# Altium project trusted_io_dvt1.PrjPcb (part 1 of 2)
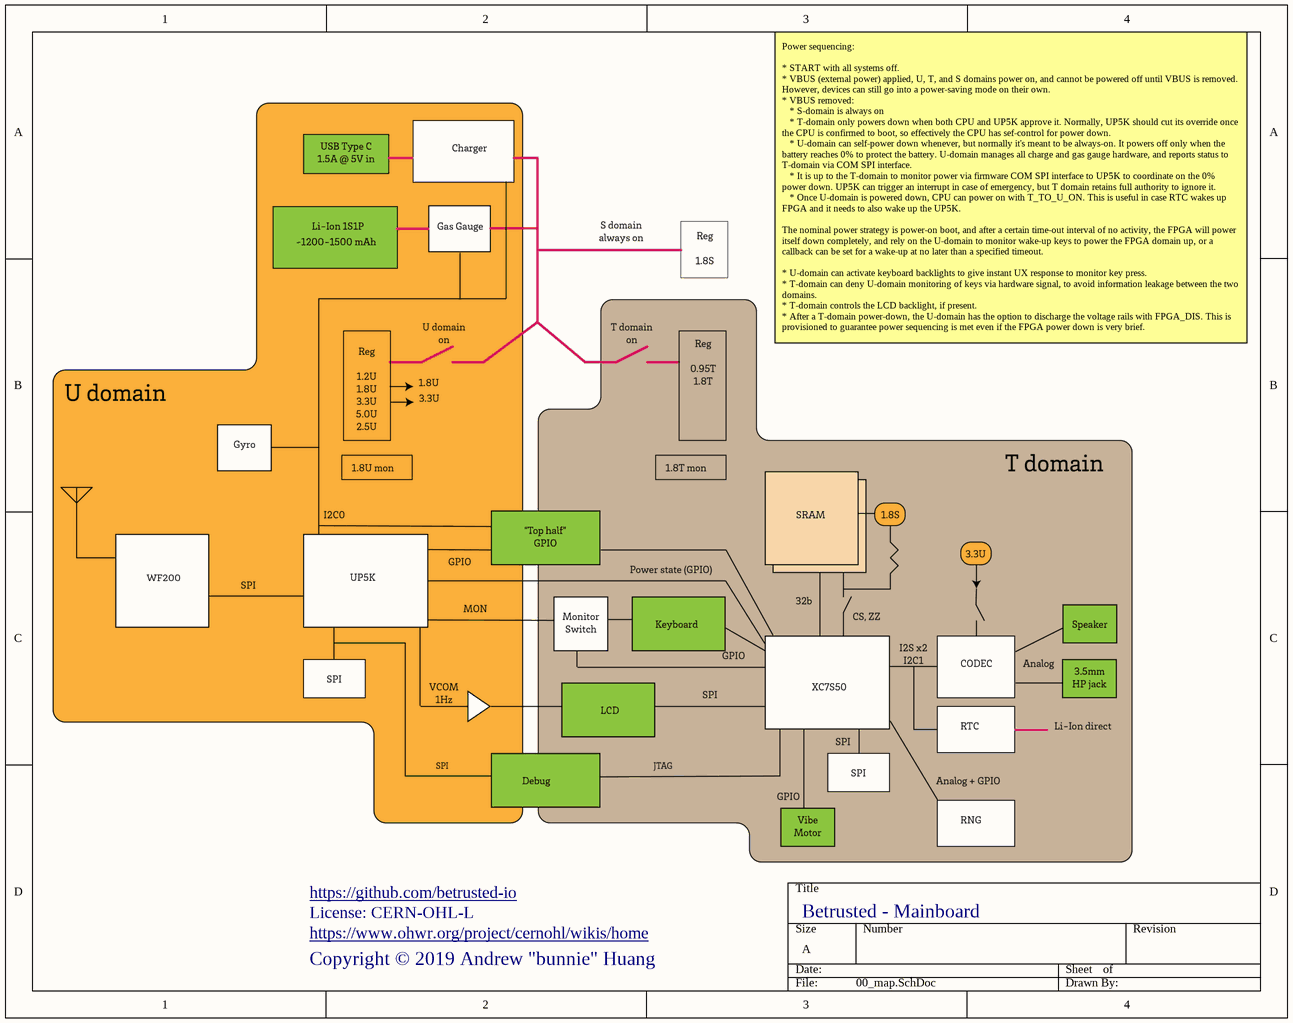
[diagram p0: 00_map.SchDoc]
8 sheets, 421 parts. Net scope: global (net labels, ports and power ports of the same name join across sheets).
Board file: betrusted_dvt1b-dfm.PcbDoc
Sheets:
  00_map.SchDoc
  01_fpga.SchDoc
  02_memory.SchDoc
  03_power.SchDoc
  04_io.SchDoc
  05_kbd_pm.SchDoc
  06_rng.SchDoc
  07_ux.SchDoc

## Sheet 00_map.SchDoc
size A

### Notes on the sheet
- Power sequencing:
  * START with all systems off.
  * VBUS (external power) applied, U, T, and S domains power on, and cannot be powered off until VBUS is removed. However, devices can still go into a power-saving mode on their own.
  * VBUS removed:
  * S-domain is always on
  * T-domain only powers down when both CPU and UP5K approve it. Normally, UP5K should cut its override once the CPU is confirmed to boot, so effectively the CPU has sef-control for power down.
  * U-domain can self-power down whenever, but normally it's meant to be always-on. It powers off only when the battery reaches 0% to protect the battery. U-domain manages all charge and gas gauge hardware, and reports status to T-domain via COM SPI interface.
  * It is up to the T-domain to monitor power via firmware COM SPI interface to UP5K to coordinate on the 0% power down. UP5K can trigger an interrupt in case of emergency, but T domain retains full authority to ignore it.
  * Once U-domain is powered down, CPU can power on with T_TO_U_ON. This is useful in case RTC wakes up FPGA and it needs to also wake up the UP5K.
  The nominal power strategy is power-on boot, and after a certain time-out interval of no activity, the FPGA will power itself down completely, and rely on the U-domain to monitor wake-up keys to power the FPGA domain up, or a callback can be set for a wake-up at no later than a specified timeout.
  * U-domain can activate keyboard backlights to give instant UX response to monitor key press.
  * T-domain can deny U-domain monitoring of keys via hardware signal, to avoid information leakage between the two domains.
  * T-domain controls the LCD backlight, if present.
  * After a T-domain power-down, the U-domain has the option to discharge the voltage rails with FPGA_DIS. This is provisioned to guarantee power sequencing is met even if the FPGA power down is very brief.
- https://github.com/betrusted-io
- License: CERN-OHL-L
- Copyright © 2019 Andrew "bunnie" Huang
- https://www.ohwr.org/project/cernohl/wikis/home
- Betrusted - Mainboard

## Sheet 01_fpga.SchDoc
size A2; VENDOR: TI; MPN: SN74AUC1G66YZPR; MYPN: U-SN74AUC1G66YZPR
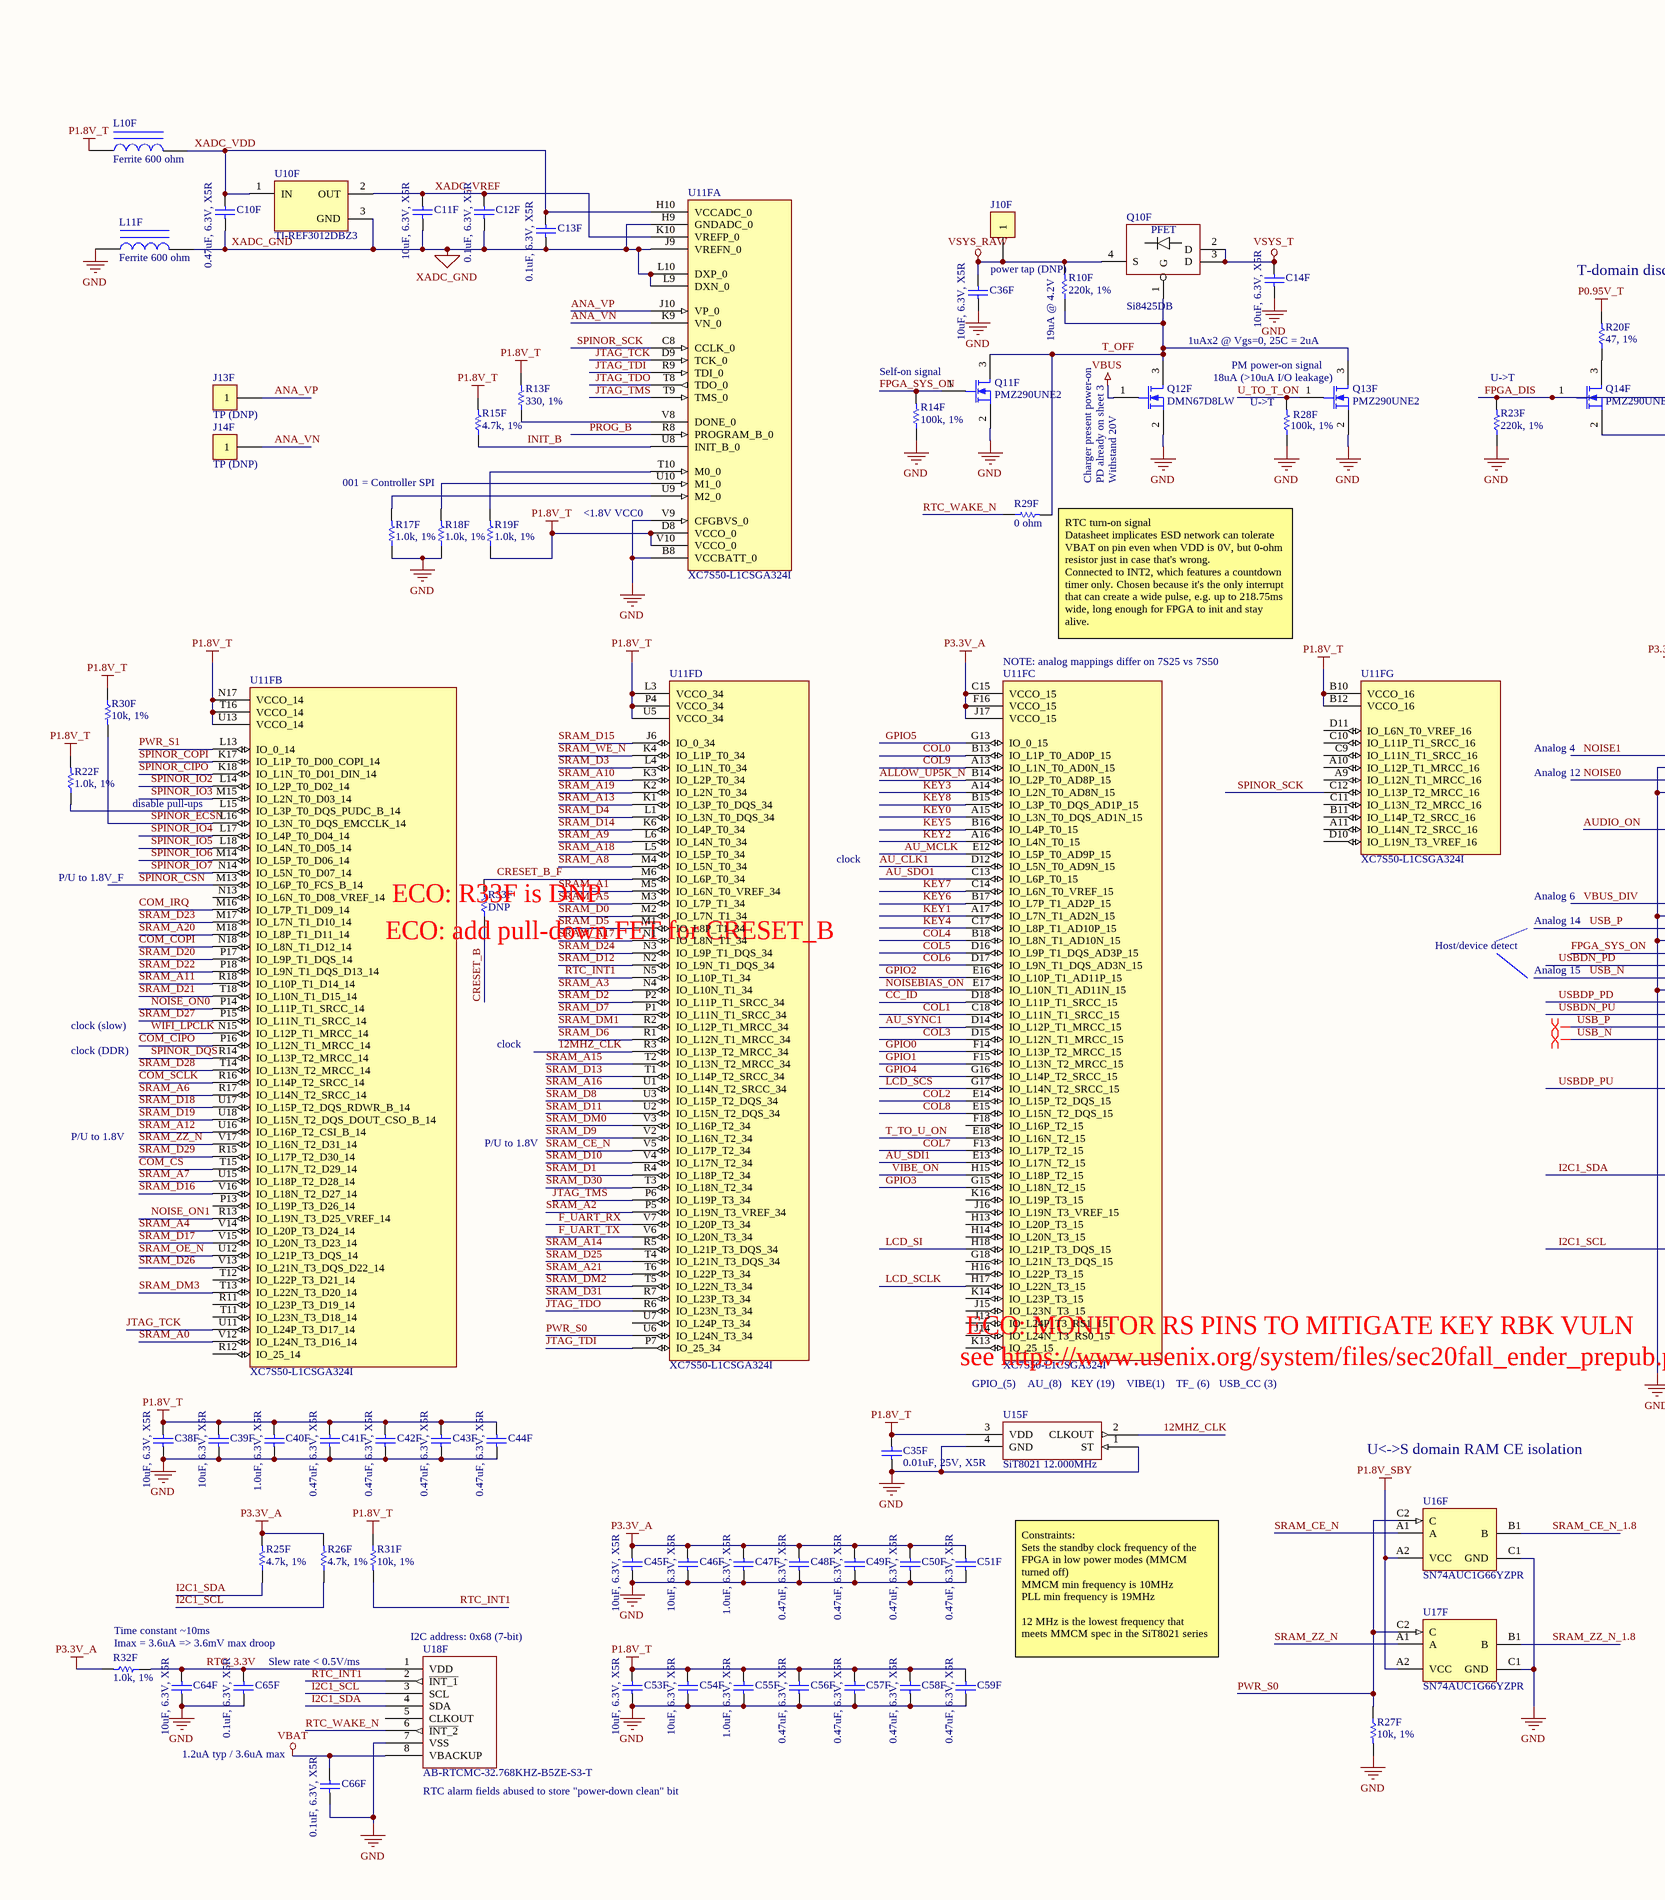
[diagram p1: 01_fpga.SchDoc, left]
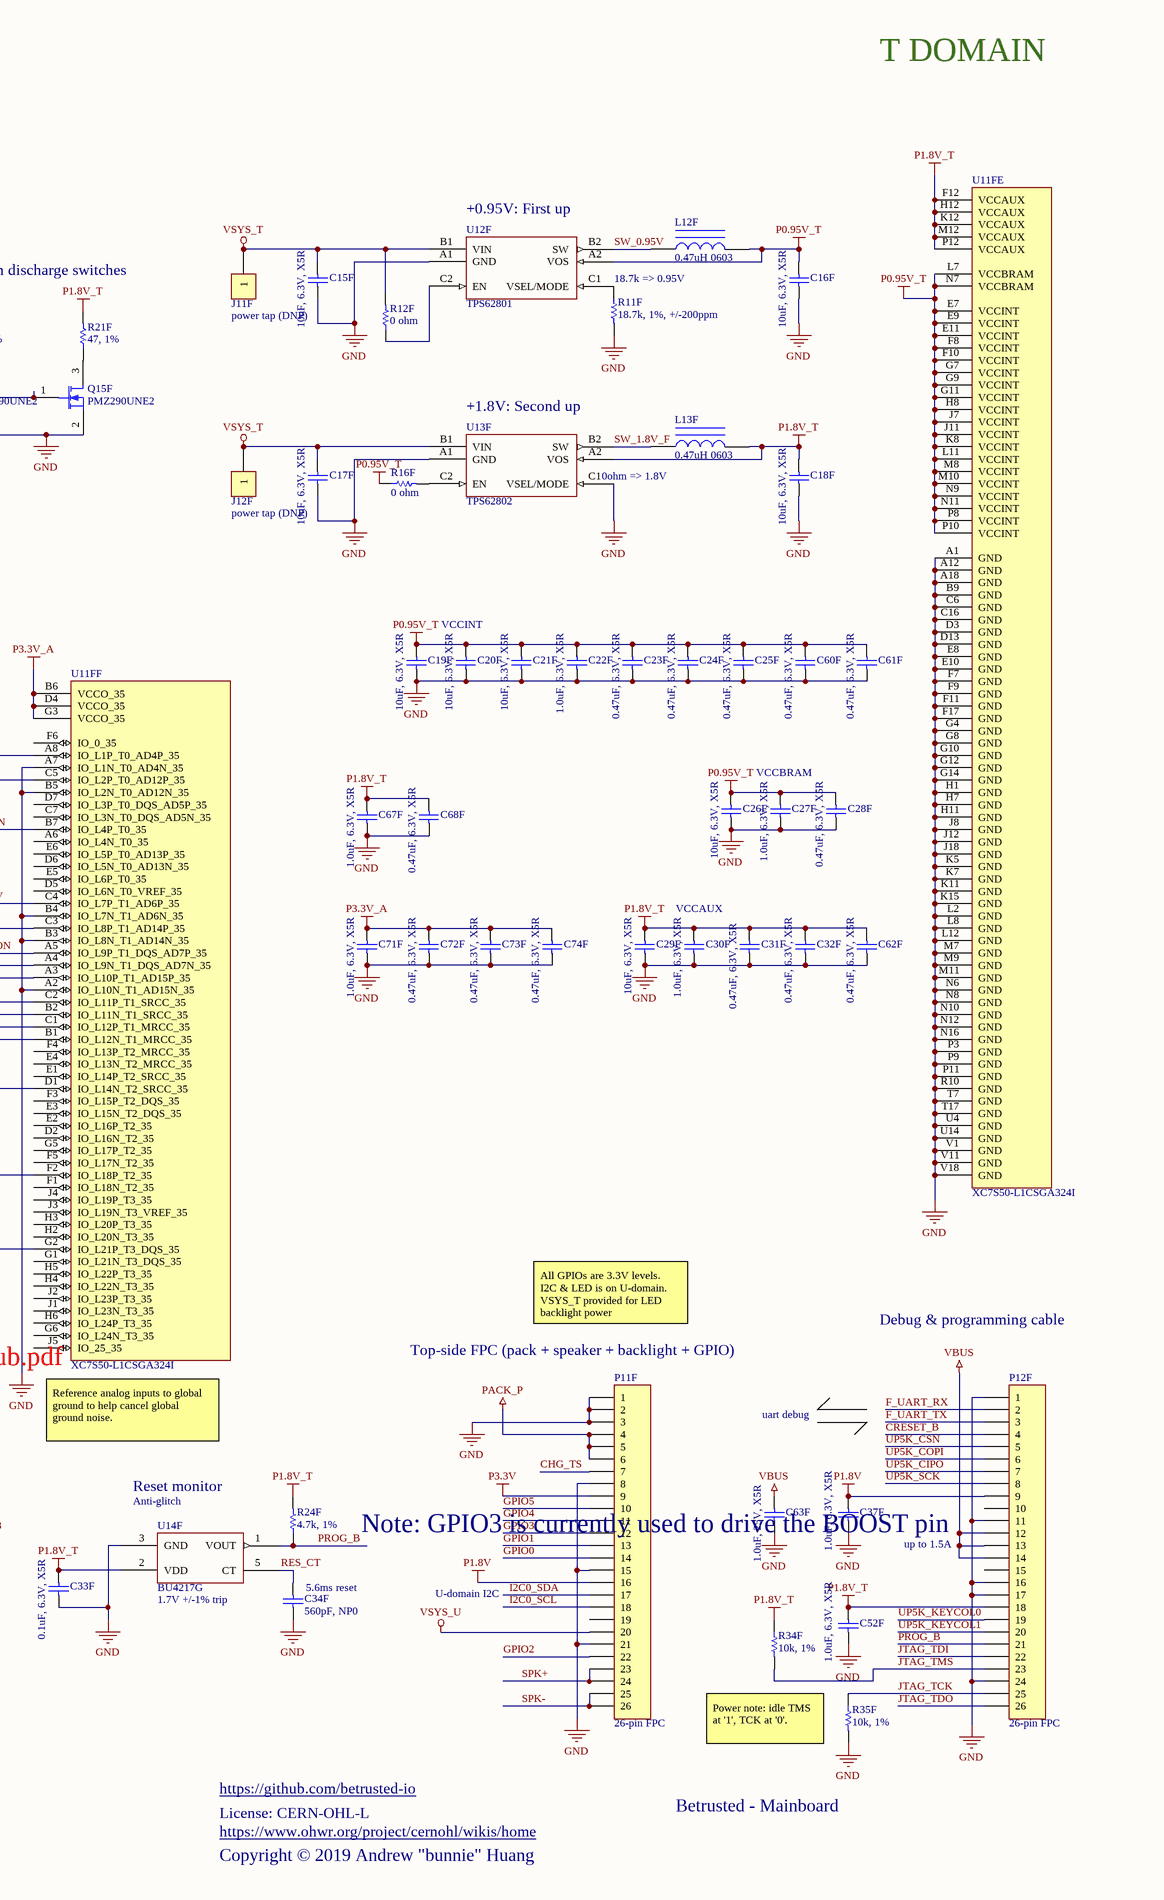
[diagram p2: 01_fpga.SchDoc, right]

### Parts
C10F  0.47uF, 6.3V, X5R  [B_CAP0201]
C11F  10uF, 6.3V, X5R  [B_CAP0603]
C12F  0.1uF, 6.3V, X5R  [B_CAP0201]
C13F  0.1uF, 6.3V, X5R  [B_CAP0201]
C14F  10uF, 6.3V, X5R  [B_CAP0603]
C15F  10uF, 6.3V, X5R  [B_CAP0603]
C16F  10uF, 6.3V, X5R  [B_CAP0603]
C17F  10uF, 6.3V, X5R  [B_CAP0603]
C18F  10uF, 6.3V, X5R  [B_CAP0603]
C19F  10uF, 6.3V, X5R  [B_CAP0603]
C20F  10uF, 6.3V, X5R  [B_CAP0603]
C21F  10uF, 6.3V, X5R  [B_CAP0603]
C22F  1.0uF, 6.3V, X5R  [B_CAP0201]
C23F  0.47uF, 6.3V, X5R  [B_CAP0201]
C24F  0.47uF, 6.3V, X5R  [B_CAP0201]
C25F  0.47uF, 6.3V, X5R  [B_CAP0201]
C26F  10uF, 6.3V, X5R  [B_CAP0603]
C27F  1.0uF, 6.3V, X5R  [B_CAP0201]
C28F  0.47uF, 6.3V, X5R  [B_CAP0201]
C29F  10uF, 6.3V, X5R  [B_CAP0603]
C30F  1.0uF, 6.3V, X5R  [B_CAP0201]
C31F  0.47uF, 6.3V, X5R  [B_CAP0201]
C32F  0.47uF, 6.3V, X5R  [B_CAP0201]
C33F  0.1uF, 6.3V, X5R  [B_CAP0201]
C34F  560pF, NP0  [B_RES0201]
C35F  0.01uF, 25V, X5R  [B_RES0201]
C36F  10uF, 6.3V, X5R  [B_CAP0603]
C37F  1.0uF, 6.3V, X5R  [B_CAP0201]
C38F  10uF, 6.3V, X5R  [B_CAP0603]
C39F  10uF, 6.3V, X5R  [B_CAP0603]
C40F  1.0uF, 6.3V, X5R  [B_CAP0201]
C41F  0.47uF, 6.3V, X5R  [B_CAP0201]
C42F  0.47uF, 6.3V, X5R  [B_CAP0201]
C43F  0.47uF, 6.3V, X5R  [B_CAP0201]
C44F  0.47uF, 6.3V, X5R  [B_CAP0201]
C45F  10uF, 6.3V, X5R  [B_CAP0603]
C46F  10uF, 6.3V, X5R  [B_CAP0603]
C47F  1.0uF, 6.3V, X5R  [B_CAP0201]
C48F  0.47uF, 6.3V, X5R  [B_CAP0201]
C49F  0.47uF, 6.3V, X5R  [B_CAP0201]
C50F  0.47uF, 6.3V, X5R  [B_CAP0201]
C51F  0.47uF, 6.3V, X5R  [B_CAP0201]
C52F  1.0uF, 6.3V, X5R  [B_CAP0201]
C53F  10uF, 6.3V, X5R  [B_CAP0603]
C54F  10uF, 6.3V, X5R  [B_CAP0603]
C55F  1.0uF, 6.3V, X5R  [B_CAP0201]
C56F  0.47uF, 6.3V, X5R  [B_CAP0201]
C57F  0.47uF, 6.3V, X5R  [B_CAP0201]
C58F  0.47uF, 6.3V, X5R  [B_CAP0201]
C59F  0.47uF, 6.3V, X5R  [B_CAP0201]
C60F  0.47uF, 6.3V, X5R  [B_CAP0201]
C61F  0.47uF, 6.3V, X5R  [B_CAP0201]
C62F  0.47uF, 6.3V, X5R  [B_CAP0201]
C63F  1.0uF, 25V, X5R  [B_CAP0603]
C64F  10uF, 6.3V, X5R  [B_CAP0603]
C65F  0.1uF, 6.3V, X5R  [B_CAP0201]
C66F  0.1uF, 6.3V, X5R  [B_CAP0201]
C67F  1.0uF, 6.3V, X5R  [B_CAP0201]
C68F  0.47uF, 6.3V, X5R  [B_CAP0201]
C71F  1.0uF, 6.3V, X5R  [B_CAP0201]
C72F  0.47uF, 6.3V, X5R  [B_CAP0201]
C73F  0.47uF, 6.3V, X5R  [B_CAP0201]
C74F  0.47uF, 6.3V, X5R  [B_CAP0201]
J10F  power tap (DNP)  [RESTAP-0603]
J11F  power tap (DNP)  [RESTAP-0603]
J12F  power tap (DNP)  [RESTAP-0603]
J13F  TP (DNP)  [TP_0.4x0.4_SMT]
J14F  TP (DNP)  [TP_0.4x0.4_SMT]
L10F  Ferrite 600 ohm  [B_IND0603]
L11F  Ferrite 600 ohm  [B_IND0603]
L12F  0.47uH 0603  [B_IND0603]
L13F  0.47uH 0603  [B_IND0603]
P11F  26-pin FPC  [HRS_FH34SRJ-26S-0.5SH(50)]
P12F  26-pin FPC  [HRS_FH34SRJ-26S-0.5SH(50)]
Q10F  Si8425DB  [VISHAY_MICRO_FOOT_4_BUMP]
Q11F  PMZ290UNE2  [SOT883]
Q12F  DMN67D8LW  [SOT323-3AN]
Q13F  PMZ290UNE2  [SOT883]
Q14F  PMZ290UNE2  [SOT883]
Q15F  PMZ290UNE2  [SOT883]
R10F  220k, 1%  [B_RES0201]
R11F  18.7k, 1%, +/-200ppm  [B_RES0402]
R12F  0 ohm  [B_RES0201]
R13F  330, 1%  [B_RES0201]
R14F  100k, 1%  [B_RES0201]
R15F  4.7k, 1%  [B_RES0201]
R16F  0 ohm  [B_RES0201]
R17F  1.0k, 1%  [B_RES0201]
R18F  1.0k, 1%  [B_RES0201]
R19F  1.0k, 1%  [B_RES0201]
R20F  47, 1%  [B_RES0402]
R21F  47, 1%  [B_RES0402]
R22F  1.0k, 1%  [B_RES0201]
R23F  220k, 1%  [B_RES0201]
R24F  4.7k, 1%  [B_RES0201]
R25F  4.7k, 1%  [B_RES0201]
R26F  4.7k, 1%  [B_RES0201]
R27F  10k, 1%  [B_RES0201]
R28F  100k, 1%  [B_RES0201]
R29F  0 ohm  [B_RES0201]
R30F  10k, 1%  [B_RES0201]
R31F  10k, 1%  [B_RES0201]
R32F  1.0k, 1%  [B_RES0201]
R33F  DNP  [B_RES0201]
R34F  10k, 1%  [B_RES0201]
R35F  10k, 1%  [B_RES0201]
U10F  TI-REF3012DBZ3  [ONSC-SOT-23-3-318-08_V]
U11F  XC7S50-L1CSGA324I  [BGA324C80P18X18_1500X1500X150]  (parts A,B,C,D,E,F,G of 7)
U12F  TPS62801  [BGA6C35P2X3_70X105X40_NSMD]
U13F  TPS62802  [BGA6C35P2X3_70X105X40_NSMD]
U14F  BU4217G  [SOT23-5AN]
U15F  SiT8021 12.000MHz  [SiTIME_CSP]
U16F  SN74AUC1G66YZPR  [YZP0005ADAD]
U17F  SN74AUC1G66YZPR  [YZP0005ADAD]
U18F  AB-RTCMC-32.768KHZ-B5ZE-S3-T  [ABRACON_RTCMC_LGA10]

### Nets
GND: C14F.2 C15F.2 C16F.2 C17F.2 C18F.2 C19F.2 C20F.2 C21F.2 C22F.1 C23F.2 C24F.2 C25F.2 C26F.2 C27F.1 C28F.2 C29F.2 C30F.1 C31F.2 C32F.2 C33F.2 C34F.2 C35F.2 C36F.2 C37F.1 C38F.2 C39F.2 C40F.1 C41F.2 C42F.2 C43F.2 C44F.2 C45F.2 C46F.2 C47F.1 C48F.2 C49F.2 C50F.2 C51F.2 C52F.1 C53F.2 C54F.2 C55F.1 C56F.2 C57F.2 C58F.2 C59F.2 C60F.2 C61F.2 C62F.2 C63F.2 C64F.2 C65F.2 C66F.2 C67F.1 C68F.2 C71F.1 C72F.2 C73F.2 C74F.2 L11F.1 P11F.1 P11F.2 P11F.3 P11F.8 P11F.15 P11F.21 P12F.1 P12F.11 P12F.16 P12F.17 P12F.24 Q11F.2(S) Q12F.2(S) Q13F.2(S) Q14F.2(S) Q15F.2(S) R11F.2 R14F.1 R17F.1 R18F.1 R23F.1 R27F.2 R28F.1 R35F.2 U11F.A1(GND) U11F.A2(IO_L10N_T1_AD15N_35) U11F.A7(IO_L1N_T0_AD4N_35) U11F.A12(GND) U11F.A18(GND) U11F.B3(IO_L8N_T1_AD14N_35) U11F.B4(IO_L7N_T1_AD6N_35) U11F.B5(IO_L2N_T0_AD12N_35) U11F.B8(VCCBATT_0) U11F.B9(GND) U11F.C6(GND) U11F.C16(GND) U11F.D3(GND) U11F.D13(GND) U11F.E8(GND) U11F.E10(GND) U11F.F7(GND) U11F.F9(GND) U11F.F11(GND) U11F.F17(GND) U11F.G4(GND) U11F.G8(GND) U11F.G10(GND) U11F.G12(GND) U11F.G14(GND) U11F.H1(GND) U11F.H7(GND) U11F.H11(GND) U11F.J8(GND) U11F.J12(GND) U11F.J18(GND) U11F.K5(GND) U11F.K7(GND) U11F.K11(GND) U11F.K15(GND) U11F.L2(GND) U11F.L8(GND) U11F.L12(GND) U11F.M7(GND) U11F.M9(GND) U11F.M11(GND) U11F.N6(GND) U11F.N8(GND) U11F.N10(GND) U11F.N12(GND) U11F.N16(GND) U11F.P3(GND) U11F.P9(GND) U11F.P11(GND) U11F.R10(GND) U11F.T7(GND) U11F.T17(GND) U11F.U4(GND) U11F.U14(GND) U11F.V1(GND) U11F.V9(CFGBVS_0) U11F.V11(GND) U11F.V18(GND) U12F.A1(GND) U13F.A1(GND) U13F.C1(VSEL/MODE) U14F.3(GND) U15F.1(ST) U15F.4(GND) U16F.C1(GND) U17F.C1(GND) U18F.7(VSS)
P0.95V_T: C16F.1 C19F.1 C20F.1 C21F.1 C22F.2 C23F.1 C24F.1 C25F.1 C26F.1 C27F.2 C28F.1 C60F.1 C61F.1 L12F.2 R16F.1 R20F.2 U11F.E7(VCCINT) U11F.E9(VCCINT) U11F.E11(VCCINT) U11F.F8(VCCINT) U11F.F10(VCCINT) U11F.G7(VCCINT) U11F.G9(VCCINT) U11F.G11(VCCINT) U11F.H8(VCCINT) U11F.J7(VCCINT) U11F.J11(VCCINT) U11F.K8(VCCINT) U11F.L7(VCCBRAM) U11F.L11(VCCINT) U11F.M8(VCCINT) U11F.M10(VCCINT) U11F.N7(VCCBRAM) U11F.N9(VCCINT) U11F.N11(VCCINT) U11F.P8(VCCINT) U11F.P10(VCCINT) U12F.A2(VOS)
P1.8V: C37F.2 P11F.16 P12F.9
P1.8V_SBY: U16F.A2(VCC) U17F.A2(VCC)
P1.8V_T: C18F.1 C29F.1 C30F.2 C31F.1 C32F.1 C33F.1 C35F.1 C38F.1 C39F.1 C40F.2 C41F.1 C42F.1 C43F.1 C44F.1 C52F.2 C53F.1 C54F.1 C55F.2 C56F.1 C57F.1 C58F.1 C59F.1 C62F.1 C67F.2 C68F.1 L10F.1 L13F.2 P12F.18 R13F.2 R15F.2 R19F.1 R21F.2 R22F.2 R24F.2 R30F.1 R31F.1 R34F.1 U11F.B10(VCCO_16) U11F.B12(VCCO_16) U11F.D8(VCCO_0) U11F.F12(VCCAUX) U11F.H12(VCCAUX) U11F.K12(VCCAUX) U11F.L3(VCCO_34) U11F.M12(VCCAUX) U11F.N17(VCCO_14) U11F.P4(VCCO_34) U11F.P12(VCCAUX) U11F.T16(VCCO_14) U11F.U5(VCCO_34) U11F.U13(VCCO_14) U11F.V10(VCCO_0) U13F.A2(VOS) U14F.2(VDD) U15F.3(VDD)
P3.3V: P11F.9
P3.3V_A: C45F.1 C46F.1 C47F.2 C48F.1 C49F.1 C50F.1 C51F.1 C71F.2 C72F.1 C73F.1 C74F.1 R25F.2 R26F.2 R32F.2 U11F.B6(VCCO_35) U11F.C15(VCCO_15) U11F.D4(VCCO_35) U11F.F16(VCCO_15) U11F.G3(VCCO_35) U11F.J17(VCCO_15)
PACK_P: P11F.4 P11F.5 P11F.6
VBAT: C66F.1 U18F.8(VBACKUP)
VBUS: C63F.1 P12F.12 P12F.13 P12F.14 Q12F.1(G)
VSYS_RAW: C36F.1 J10F.1 Q10F.4(S) R10F.2
VSYS_T: C14F.1 C15F.1 C17F.1 J11F.1 J12F.1 Q10F.2(D) Q10F.3(D) R12F.2 U12F.B1(VIN) U13F.B1(VIN)
VSYS_U: P11F.20
XADC_GND: C10F.2 C11F.2 C12F.2 C13F.2 L11F.2 U10F.3(GND) U11F.H9(GNDADC_0) U11F.J9(VREFN_0) U11F.L9(DXN_0) U11F.L10(DXP_0)
12MHZ_CLK: U11F.R3(IO_L13P_T2_MRCC_34) U15F.2(CLKOUT)
ALLOW_UP5K_N: U11F.B14(IO_L2P_T0_AD8P_15)
ANA_VN: J14F.1 U11F.K9(VN_0)
ANA_VP: J13F.1 U11F.J10(VP_0)
AU_CLK1: U11F.D12(IO_L5N_T0_AD9N_15)
AU_MCLK: U11F.E12(IO_L5P_T0_AD9P_15)
AU_SDI1: U11F.E13(IO_L17N_T2_15)
AU_SDO1: U11F.C13(IO_L6P_T0_15)
AU_SYNC1: U11F.D14(IO_L12P_T1_MRCC_15)
AUDIO_ON: U11F.B7(IO_L4P_T0_35)
CC_ID: U11F.D18(IO_L11P_T1_SRCC_15)
CHG_TS: P11F.7
COL0: U11F.B13(IO_L1P_T0_AD0P_15)
COL1: U11F.C18(IO_L11N_T1_SRCC_15)
COL2: U11F.E14(IO_L15P_T2_DQS_15)
COL3: U11F.D15(IO_L12N_T1_MRCC_15)
COL4: U11F.B18(IO_L8N_T1_AD10N_15)
COL5: U11F.D16(IO_L9P_T1_DQS_AD3P_15)
COL6: U11F.D17(IO_L9N_T1_DQS_AD3N_15)
COL7: U11F.F13(IO_L17P_T2_15)
COL8: U11F.E15(IO_L15N_T2_DQS_15)
COL9: U11F.A13(IO_L1N_T0_AD0N_15)
COM_CIPO: U11F.P16(IO_L12N_T1_MRCC_14)
COM_COPI: U11F.N18(IO_L8N_T1_D12_14)
COM_CS: U11F.T15(IO_L17N_T2_D29_14)
COM_IRQ: U11F.M16(IO_L7P_T1_D09_14)
COM_SCLK: U11F.R16(IO_L14P_T2_SRCC_14)
CRESET_B: P12F.4 R33F.1
CRESET_B_F: R33F.2 U11F.M6(IO_L6P_T0_34)
F_UART_RX: P12F.2 U11F.V7(IO_L20P_T3_34)
F_UART_TX: P12F.3 U11F.V6(IO_L20N_T3_34)
FPGA_DIS: Q14F.1(G) Q15F.1(G) R23F.2
FPGA_SYS_ON: Q11F.1(G) R14F.2 U11F.A5(IO_L9P_T1_DQS_AD7P_35)
GPIO0: P11F.14 U11F.F14(IO_L13P_T2_MRCC_15)
GPIO1: P11F.13 U11F.F15(IO_L13N_T2_MRCC_15)
GPIO2: P11F.22 U11F.E16(IO_L10P_T1_AD11P_15)
GPIO3: P11F.12 U11F.G15(IO_L18N_T2_15)
GPIO4: P11F.11 U11F.G16(IO_L14P_T2_SRCC_15)
GPIO5: P11F.10 U11F.G13(IO_0_15)
I2C0_SCL: P11F.18
I2C0_SDA: P11F.17
I2C1_SCL: R26F.1 U11F.G2(IO_L21P_T3_DQS_35) U18F.3(SCL)
I2C1_SDA: R25F.1 U11F.F2(IO_L18P_T2_35) U18F.4(SDA)
INIT_B: R15F.1 U11F.U8(INIT_B_0)
JTAG_TCK: P12F.25 R35F.1 U11F.D9(TCK_0) U11F.U11(IO_L24P_T3_D17_14)
JTAG_TDI: P12F.22 U11F.P7(IO_25_34) U11F.R9(TDI_0)
JTAG_TDO: P12F.26 U11F.R6(IO_L23N_T3_34) U11F.T8(TDO_0)
JTAG_TMS: P12F.23 R34F.2 U11F.P6(IO_L19P_T3_34) U11F.T9(TMS_0)
KEY0: U11F.A15(IO_L3N_T0_DQS_AD1N_15)
KEY1: U11F.A17(IO_L7N_T1_AD2N_15)
KEY2: U11F.A16(IO_L4N_T0_15)
KEY3: U11F.A14(IO_L2N_T0_AD8N_15)
KEY4: U11F.C17(IO_L8P_T1_AD10P_15)
KEY5: U11F.B16(IO_L4P_T0_15)
KEY6: U11F.B17(IO_L7P_T1_AD2P_15)
KEY7: U11F.C14(IO_L6N_T0_VREF_15)
KEY8: U11F.B15(IO_L3P_T0_DQS_AD1P_15)
LCD_SCLK: U11F.H17(IO_L22N_T3_15)
LCD_SCS: U11F.G17(IO_L14N_T2_SRCC_15)
LCD_SI: U11F.H18(IO_L21P_T3_DQS_15)
NOISE0: U11F.C5(IO_L2P_T0_AD12P_35)
NOISE1: U11F.A8(IO_L1P_T0_AD4P_35)
NOISE_ON0: U11F.P14(IO_L11P_T1_SRCC_14)
NOISE_ON1: U11F.R13(IO_L19N_T3_D25_VREF_14)
NOISEBIAS_ON: U11F.E17(IO_L10N_T1_AD11N_15)
PROG_B: P12F.21 R24F.1 U11F.R8(PROGRAM_B_0) U14F.1(VOUT)
PWR_S0: R27F.1 U11F.U6(IO_L24N_T3_34) U16F.C2(C) U17F.C2(C)
PWR_S1: U11F.L13(IO_0_14)
RES_CT: C34F.1 U14F.5(CT)
RTC_3.3V: C64F.1 C65F.1 R32F.1 U18F.1(VDD)
RTC_INT1: R31F.2 U11F.N5(IO_L10P_T1_34) U18F.2(~{INT_1})
RTC_WAKE_N: R29F.1 U18F.6(~{INT_2})
SPINOR_CIPO: U11F.K18(IO_L1N_T0_D01_DIN_14)
SPINOR_COPI: U11F.K17(IO_L1P_T0_D00_COPI_14)
SPINOR_CSN: U11F.M13(IO_L6P_T0_FCS_B_14)
SPINOR_DQS: U11F.R14(IO_L13P_T2_MRCC_14)
SPINOR_ECSN: R30F.2 U11F.L16(IO_L3N_T0_DQS_EMCCLK_14)
SPINOR_IO2: U11F.L14(IO_L2P_T0_D02_14)
SPINOR_IO3: U11F.M15(IO_L2N_T0_D03_14)
SPINOR_IO4: U11F.L17(IO_L4P_T0_D04_14)
SPINOR_IO5: U11F.L18(IO_L4N_T0_D05_14)
SPINOR_IO6: U11F.M14(IO_L5P_T0_D06_14)
SPINOR_IO7: U11F.N14(IO_L5N_T0_D07_14)
SPINOR_SCK: U11F.C8(CCLK_0) U11F.C12(IO_L13P_T2_MRCC_16)
SPK+: P11F.23 P11F.24
SPK-: P11F.25 P11F.26
SRAM_A0: U11F.V12(IO_L24N_T3_D16_14)
SRAM_A1: U11F.M5(IO_L6N_T0_VREF_34)
SRAM_A2: U11F.P5(IO_L19N_T3_VREF_34)
SRAM_A3: U11F.N4(IO_L10N_T1_34)
SRAM_A4: U11F.V14(IO_L20P_T3_D24_14)
SRAM_A5: U11F.M3(IO_L7P_T1_34)
SRAM_A6: U11F.R17(IO_L14N_T2_SRCC_14)
SRAM_A7: U11F.U15(IO_L18P_T2_D28_14)
SRAM_A8: U11F.M4(IO_L5N_T0_34)
SRAM_A9: U11F.L6(IO_L4N_T0_34)
SRAM_A10: U11F.K3(IO_L2P_T0_34)
SRAM_A11: U11F.R18(IO_L10P_T1_D14_14)
SRAM_A12: U11F.U16(IO_L16P_T2_CSI_B_14)
SRAM_A13: U11F.K1(IO_L3P_T0_DQS_34)
SRAM_A14: U11F.R5(IO_L21P_T3_DQS_34)
SRAM_A15: U11F.T2(IO_L13N_T2_MRCC_34)
SRAM_A16: U11F.U1(IO_L14N_T2_SRCC_34)
SRAM_A17: U11F.N1(IO_L8N_T1_34)
SRAM_A18: U11F.L5(IO_L5P_T0_34)
SRAM_A19: U11F.K2(IO_L2N_T0_34)
SRAM_A20: U11F.M18(IO_L8P_T1_D11_14)
SRAM_A21: U11F.T6(IO_L22P_T3_34)
SRAM_CE_N: U11F.V5(IO_L17P_T2_34) U16F.A1(A)
SRAM_CE_N_1.8: U16F.B1(B)
SRAM_D0: U11F.M2(IO_L7N_T1_34)
SRAM_D1: U11F.R4(IO_L18P_T2_34)
SRAM_D2: U11F.P2(IO_L11P_T1_SRCC_34)
SRAM_D3: U11F.L4(IO_L1N_T0_34)
SRAM_D4: U11F.L1(IO_L3N_T0_DQS_34)
SRAM_D5: U11F.M1(IO_L8P_T1_34)
SRAM_D6: U11F.R1(IO_L12N_T1_MRCC_34)
SRAM_D7: U11F.P1(IO_L11N_T1_SRCC_34)
SRAM_D8: U11F.U3(IO_L15P_T2_DQS_34)
SRAM_D9: U11F.V2(IO_L16N_T2_34)
SRAM_D10: U11F.V4(IO_L17N_T2_34)
SRAM_D11: U11F.U2(IO_L15N_T2_DQS_34)
SRAM_D12: U11F.N2(IO_L9N_T1_DQS_34)
SRAM_D13: U11F.T1(IO_L14P_T2_SRCC_34)
SRAM_D14: U11F.K6(IO_L4P_T0_34)
SRAM_D15: U11F.J6(IO_0_34)
SRAM_D16: U11F.V16(IO_L18N_T2_D27_14)
SRAM_D17: U11F.V15(IO_L20N_T3_D23_14)
SRAM_D18: U11F.U17(IO_L15P_T2_DQS_RDWR_B_14)
SRAM_D19: U11F.U18(IO_L15N_T2_DQS_DOUT_CSO_B_14)
SRAM_D20: U11F.P17(IO_L9P_T1_DQS_14)
SRAM_D21: U11F.T18(IO_L10N_T1_D15_14)
SRAM_D22: U11F.P18(IO_L9N_T1_DQS_D13_14)
SRAM_D23: U11F.M17(IO_L7N_T1_D10_14)
SRAM_D24: U11F.N3(IO_L9P_T1_DQS_34)
SRAM_D25: U11F.T4(IO_L21N_T3_DQS_34)
SRAM_D26: U11F.V13(IO_L21N_T3_DQS_D22_14)
SRAM_D27: U11F.P15(IO_L11N_T1_SRCC_14)
SRAM_D28: U11F.T14(IO_L13N_T2_MRCC_14)
SRAM_D29: U11F.R15(IO_L17P_T2_D30_14)
SRAM_D30: U11F.T3(IO_L18N_T2_34)
SRAM_D31: U11F.R7(IO_L23P_T3_34)
SRAM_DM0: U11F.V3(IO_L16P_T2_34)
SRAM_DM1: U11F.R2(IO_L12P_T1_MRCC_34)
SRAM_DM2: U11F.T5(IO_L22N_T3_34)
SRAM_DM3: U11F.T13(IO_L22N_T3_D20_14)
SRAM_OE_N: U11F.U12(IO_L21P_T3_DQS_14)
SRAM_WE_N: U11F.K4(IO_L1P_T0_34)
SRAM_ZZ_N: U11F.V17(IO_L16N_T2_D31_14) U17F.A1(A)
SRAM_ZZ_N_1.8: U17F.B1(B)
SW_0.95V: L12F.1 U12F.B2(SW)
SW_1.8V_F: L13F.1 U13F.B2(SW)
T_OFF: Q10F.1(G) Q11F.3(D) Q12F.3(D) Q13F.3(D) R10F.1 R29F.2
T_TO_U_ON: U11F.E18(IO_L16N_T2_15)
U_TO_T_ON: Q13F.1(G) R28F.2
UP5K_CIPO: P12F.7
UP5K_COPI: P12F.6
UP5K_CSN: P12F.5
UP5K_KEYCOL0: P12F.19
UP5K_KEYCOL1: P12F.20
UP5K_SCK: P12F.8
USB_N: U11F.A3(IO_L10P_T1_AD15P_35) U11F.B1(IO_L12N_T1_MRCC_35)
USB_P: U11F.C1(IO_L12P_T1_MRCC_35) U11F.C3(IO_L8P_T1_AD14P_35)
USBDN_PD: U11F.A4(IO_L9N_T1_DQS_AD7N_35)
USBDN_PU: U11F.B2(IO_L11N_T1_SRCC_35)
USBDP_PD: U11F.C2(IO_L11P_T1_SRCC_35)
USBDP_PU: U11F.D1(IO_L14N_T2_SRCC_35)
VBUS_DIV: U11F.C4(IO_L7P_T1_AD6P_35)
VIBE_ON: U11F.H15(IO_L18P_T2_15)
WIFI_LPCLK: U11F.N15(IO_L12P_T1_MRCC_14)
XADC_VDD: C10F.1 C13F.1 L10F.2 U10F.1(IN) U11F.H10(VCCADC_0)
XADC_VREF: C11F.1 C12F.1 U10F.2(OUT) U11F.K10(VREFP_0)
NetQ14F_3: Q14F.3(D) R20F.1
NetQ15F_3: Q15F.3(D) R21F.1
NetR11F_1: R11F.1 U12F.C1(VSEL/MODE)
NetR12F_1: R12F.1 U12F.C2(EN)
NetR13F_1: R13F.1 U11F.V8(DONE_0)
NetR16F_2: R16F.2 U13F.C2(EN)
NetR17F_2: R17F.2 U11F.U9(M2_0)
NetR18F_2: R18F.2 U11F.U10(M1_0)
NetR19F_2: R19F.2 U11F.T10(M0_0)
NetR22F_1: R22F.1 U11F.L15(IO_L3P_T0_DQS_PUDC_B_14)

Not connected (* = marked no-connect by the designer): P11F 19; P12F 10 15; U11F A6(IO_L4N_T0_35) A9(IO_L12N_T1_MRCC_16) A10(IO_L12P_T1_MRCC_16) A11(IO_L14N_T2_SRCC_16) B11(IO_L14P_T2_SRCC_16) C7(IO_L3N_T0_DQS_AD5N_35) C9(IO_L11N_T1_SRCC_16) C10(IO_L11P_T1_SRCC_16) C11(IO_L13N_T2_MRCC_16) D2(IO_L16N_T2_35) D5(IO_L6N_T0_VREF_35) D6(IO_L5N_T0_AD13N_35) D7(IO_L3P_T0_DQS_AD5P_35) D10(IO_L19N_T3_VREF_16) D11(IO_L6N_T0_VREF_16) E1(IO_L14P_T2_SRCC_35) E2(IO_L16P_T2_35) E3(IO_L15N_T2_DQS_35) E4(IO_L13N_T2_MRCC_35) E5(IO_L6P_T0_35) E6(IO_L5P_T0_AD13P_35) F1(IO_L18N_T2_35) F3(IO_L15P_T2_DQS_35) F4(IO_L13P_T2_MRCC_35) F5(IO_L17N_T2_35) F6(IO_0_35) F18(IO_L16P_T2_15) G1(IO_L21N_T3_DQS_35) G5(IO_L17P_T2_35) G6(IO_L24N_T3_35) G18(IO_L21N_T3_DQS_15) H2(IO_L20N_T3_35) H3(IO_L20P_T3_35) H4(IO_L22N_T3_35) H5(IO_L22P_T3_35) H6(IO_L24P_T3_35) H13(IO_L20P_T3_15) H14(IO_L20N_T3_15) H16(IO_L22P_T3_15) J1(IO_L23N_T3_35) J2(IO_L23P_T3_35) J3(IO_L19N_T3_VREF_35) J4(IO_L19P_T3_35) J5(IO_25_35) J13(IO_L24P_T3_RS1_15) J14(IO_L24N_T3_RS0_15) J15(IO_L23N_T3_15) J16(IO_L19N_T3_VREF_15) K13(IO_25_15) K14(IO_L23P_T3_15) K16(IO_L19P_T3_15) N13(IO_L6N_T0_D08_VREF_14) P13(IO_L19P_T3_D26_14) R11(IO_L23P_T3_D19_14) R12(IO_25_14) T11(IO_L23N_T3_D18_14) T12(IO_L22P_T3_D21_14) U7(IO_L24P_T3_34); U18F 5(CLKOUT)

### Layout directives
differential pair: USB_N, USB_P

### Notes on the sheet
- T DOMAIN
- (near U12F) +0.95V: First up
- (near R10F) 19uA @ 4.2V
- T-domain discharge switches
- (near R11F) 18.7k => 0.95V
- (near Q11F) Self-on signal
- 1uAx2 @ Vgs=0, 25C = 2uA
- (near Q13F) 18uA (>10uA I/O leakage)
- (near Q13F) PM power-on signal
- (near R23F) U->T
- (near R28F) U->T
- (near U13F) +1.8V: Second up
- 001 = Controller SPI
- <1.8V VCC0
- Charger present power-on
- (near Q12F) PD already on sheet 3
- (near Q12F) Withstand 20V
- 0ohm => 1.8V
- (near R29F) RTC turn-on signal
  Datasheet implicates ESD network can tolerate VBAT on pin even when VDD is 0V, but 0-ohm resistor just in case that's wrong.
  Connected to INT2, which features a countdown timer only. Chosen because it's the only interrupt that can create a wide pulse, e.g. up to 218.75ms wide, long enough for FPGA to init and stay alive.
- VCCINT
- (near U11F) NOTE: analog mappings differ on 7S25 vs 7S50
- Analog 4
- (near U11F) disable pull-ups
- Analog 12
- VCCBRAM
- P/U to 1.8V_F
- clock
- ECO: add pull-down FET for CRESET_B
- (near R33F) ECO: R33F is DNP
- Host/device detect
- Analog 6
- Analog 14
- VCCAUX
- Analog 15
- clock (DDR)
- clock (slow)
- P/U to 1.8V
- All GPIOs are 3.3V levels.
  I2C & LED is on U-domain.
  VSYS_T provided for LED backlight power
- Debug & programming cable
- (near U11F) see https://www.usenix.org/system/files/sec20fall_ender_prepub.pdf
- (near U11F) ECO: MONITOR RS PINS TO MITIGATE KEY RBK VULN
- (near P11F) Top-side FPC (pack + speaker + backlight + GPIO)
- GPIO_(5)
- AU_(8)
- (near U15F) KEY (19)
- VIBE(1)
- TF_ (6)
- USB_CC (3)
- (near U11F) Reference analog inputs to global ground to help cancel global ground noise.
- uart debug
- U<->S domain RAM CE isolation
- Reset monitor
- (near U14F) Anti-glitch
- Note: GPIO3 is currently used to drive the BOOST pin
- up to 1.5A
- (near U14F) 1.7V +/-1% trip
- (near C34F) 5.6ms reset
- U-domain I2C
- Imax = 3.6uA => 3.6mV max droop
- Time constant ~10ms
- (near C65F) Slew rate < 0.5V/ms
- (near U18F) I2C address: 0x68 (7-bit)
- Constraints:
  Sets the standby clock frequency of the FPGA in low power modes (MMCM turned off)
  MMCM min frequency is 10MHz
  PLL min frequency is 19MHz
  12 MHz is the lowest frequency that meets MMCM spec in the SiT8021 series
- Power note: idle TMS at '1', TCK at '0'.
- 1.2uA typ / 3.6uA max
- (near U18F) RTC alarm fields abused to store "power-down clean" bit
- License: CERN-OHL-L
- https://github.com/betrusted-io
- Betrusted - Mainboard
- Copyright © 2019 Andrew "bunnie" Huang
- https://www.ohwr.org/project/cernohl/wikis/home
- (in symbol Si8425DB) PFET

### Library data of the parts
C10F C23F C24F C25F C28F C31F C32F C41F C42F C43F C44F C48F C49F C50F C51F C56F C57F C58F C59F C60F C61F C62F C68F C72F C73F C74F = Cap Semi: Capacitor (Semiconductor SIM Model); MPN: CL03A474KQ3NNNH; VENDOR: Samsung; MYPN: C-474-6p3-X5R-0201
C11F C14F C15F C16F C17F C18F C19F C20F C21F C26F C29F C36F C38F C39F C45F C46F C53F C54F C64F = Cap Semi: Capacitor (Semiconductor SIM Model); MPN: CL10A106MQ8NNNC; VENDOR: Samsung; MYPN: C-106-6.3-X5R-0603
C12F C13F C33F C65F C66F = Cap Semi: Capacitor (Semiconductor SIM Model); MPN: CL03A104KQ3NNNC; VENDOR: Samsung; MYPN: C-104-6p3-X5R-0201
C22F C27F C30F C37F C40F C47F C52F C55F C67F C71F = Cap Semi: Capacitor (Semiconductor SIM Model); MPN: GRM033R60J105MEA2D; VENDOR: Murata; MYPN: C-105-6p3-X5R-0201
C34F = Cap Semi: Capacitor (Semiconductor SIM Model); MPN: GRM0335C1E561JA01D; VENDOR: Murata; MYPN: C-561-25-NP0-0201
C35F = Cap Semi: Capacitor (Semiconductor SIM Model); MPN: GRM033R61E103KA12D; VENDOR: Murata; MYPN: C-103-25-X5R-0201
C63F = Cap Semi: Capacitor (Semiconductor SIM Model); MPN: CL10A105KA8NNNC; VENDOR: Samsung; MYPN: C-105-25-X5R-0603
J10F J11F J12F J13F J14F = CON1: Connector; MYPN: J-TP-PWRTAP-0603; MPN: DNP; VENDOR: DNP
L10F L11F = Inductor Iron: Magnetic-Core Inductor; MPN: BLM18AG601SN1D; VENDOR: Murata; MYPN: L-BLM18AG601SN1D
L12F L13F = Inductor Iron: Magnetic-Core Inductor; MPN: TFM160808ALC-R47MTAA; VENDOR: TDK; MYPN: L-TFM160808ALC-R47MTAA
P11F = FPC-26: 26 Pin FPC header; MPN: FH34SRJ-26S-0.5SH(99); MYPN: J-FPC-0.5mm-26-0.3mm-T/B; VENDOR: Hirose; System: Connector
P12F = FPC-26: 26 Pin FPC header; MPN: FH34SRJ-26S-0.5SH(99); MYPN: J-FPC-0.5mm-26-0.3mm-T/B; VENDOR: Hirose
Q10F = Si8425DB: P-channel 20V 6.2A 27mOhm @ -2.5V; MPN: SI8457DB-T1-E1; VENDOR: Vishay Siliconix; MYPN: Q-Si8457
Q11F Q13F Q14F Q15F = MOSFET-N: N-Channel MOSFET; VENDOR: Nexperia; MYPN: Q-PMZ290UNE2; Published: 8-Jun-2000; LatestRevisionDate: 17-Jul-2002; LatestRevisionNote: Re-released for DXP Platform.; PackageVersion: 1995/1996; PackageReference: E3; Publisher: Altium Limited; MPN: PMZ290UNE2
Q12F = MOSFET-N: N-Channel MOSFET; VENDOR: Diodes Inc; MYPN: Q-DMN67D8LW; Published: 8-Jun-2000; LatestRevisionDate: 17-Jul-2002; LatestRevisionNote: Re-released for DXP Platform.; PackageVersion: 1995/1996; PackageReference: E3; Publisher: Altium Limited; MPN: DMN67D8LW
R10F R23F = Res1: Resistor; VENDOR: ANY; MYPN: R-224-1P-1_16W-0201; MPN: ANY
R11F = Res1: Resistor; MPN: RC0402FR-0718K7L; VENDOR: Yageo; MYPN: R-1872-1P-1_16W-0402
R12F R16F R29F = Res1: Resistor; VENDOR: ANY; MYPN: R-0R0-1P-1_16W-0201; MPN: ANY
R13F = Res1: Resistor; VENDOR: ANY; MYPN: R-331-1P-1_16W-0201; MPN: ANY
R14F R28F = Res1: Resistor; VENDOR: ANY; MYPN: R-104-1P-1_16W-0201; MPN: ANY
R15F R24F R25F R26F = Res1: Resistor; VENDOR: ANY; MYPN: R-472-1P-1_16W-0201; MPN: ANY
R17F R18F R19F R22F R32F = Res1: Resistor; VENDOR: ANY; MYPN: R-102-1P-1_16W-0201; MPN: ANY
R20F R21F = Res1: Resistor; VENDOR: ANY; MYPN: R-470-1P-1_16W-0402; MPN: ANY
R27F R30F R31F R34F R35F = Res1: Resistor; VENDOR: ANY; MYPN: R-103-1P-1_16W-0201; MPN: ANY
R33F = Res1: Resistor; VENDOR: ANY; MYPN: DNP; MPN: ANY
U10F = TI-REF3012DBZ3: MPN: REF3012AIDBZT; VENDOR: TI; MYPN: U-REF3012AIDBZR(T/R)
U11F = XC7S50CSGA324: Spartan 7 FPGA in CSGA324 package; VENDOR: XILINX; MYPN: U-XC7S50-CSGA324; MPN: XC7S50-L1CSGA324I
U12F = TPS62801: Buck regulator, 4MHz, 0.6A, 0.8V-1.55V, low Iq; MPN: TPS62801YKAT; VENDOR: TI; MYPN: U-TPS62801YKA(T/R)
U13F = TPS62802: Buck regulator, 4MHz, 0.6A, 1.8V-3.3V, low Iq; MPN: TPS62802YKAR; VENDOR: TI; MYPN: U-TPS62802YKA(T/R)
U14F = BU42XXG: Low voltage free delay time setting CMOS voltage detector IC; MPN: BU4217G-TR; MYPN: U-BU4217G-TR; VENDOR: Rohm
U15F = SiT8021: 1 to 26 MHz micropower oscillator; MPN: SIT8021AI-J4-18S-12.000000E; VENDOR: SiTime; MYPN: U-SIT8021AI-J4-18S-12.000000E
U16F U17F = CMP-0859-01029-3: Single Bilateral Analog Switch, YZP0005ADAD, LARGE T&R; Manufacturer: Texas Instruments; ICC @ Nom Voltage(Max)(mA): 0.01; Bits(#): 1; Input Type: CMOS; VCC(Max)(V): 2.7; Rating: Catalog; Schmitt Trigger: No; Logic: True; tpd @ Nom Voltage(Max)(ns): 0.9,0.3,0.2,0.1; Technology Family: AUC; Output Drive (IOL/IOH)(Max)(mA): 9/-9; Voltage(Nom)(V): 0.8,1.2,1.5,1.8,2.5; VCC(Min)(V): 0.8; Switch Configuration: SPST; F @ Nom Voltage(Max)(Mhz): 250; VENDOR: TI; Output Type: CMOS; PackageReference: YZP0005ADAD; DatasheetVersion: SCES386L; Sub-Family: Analog Switch; Operating Temperature Range(C): -40 to 85; Channels(#): 1; 3-State Output: No; Generic Part Number: SN74AUC1G66; MYPN: SN74AUC1G66YZPR; MPN: SN74AUC1G66YZPR
U18F = AB-RTCMC-32.768kHZ-B5ZE-S3: RTC Module with I2C Bus; MYPN: U-AB-RTCMC-32.768KHZ-B5ZE-S3-T; VENDOR: Abracon; MPN: AB-RTCMC-32.768KHZ-B5ZE-S3-T

## Sheet 02_memory.SchDoc
size A4
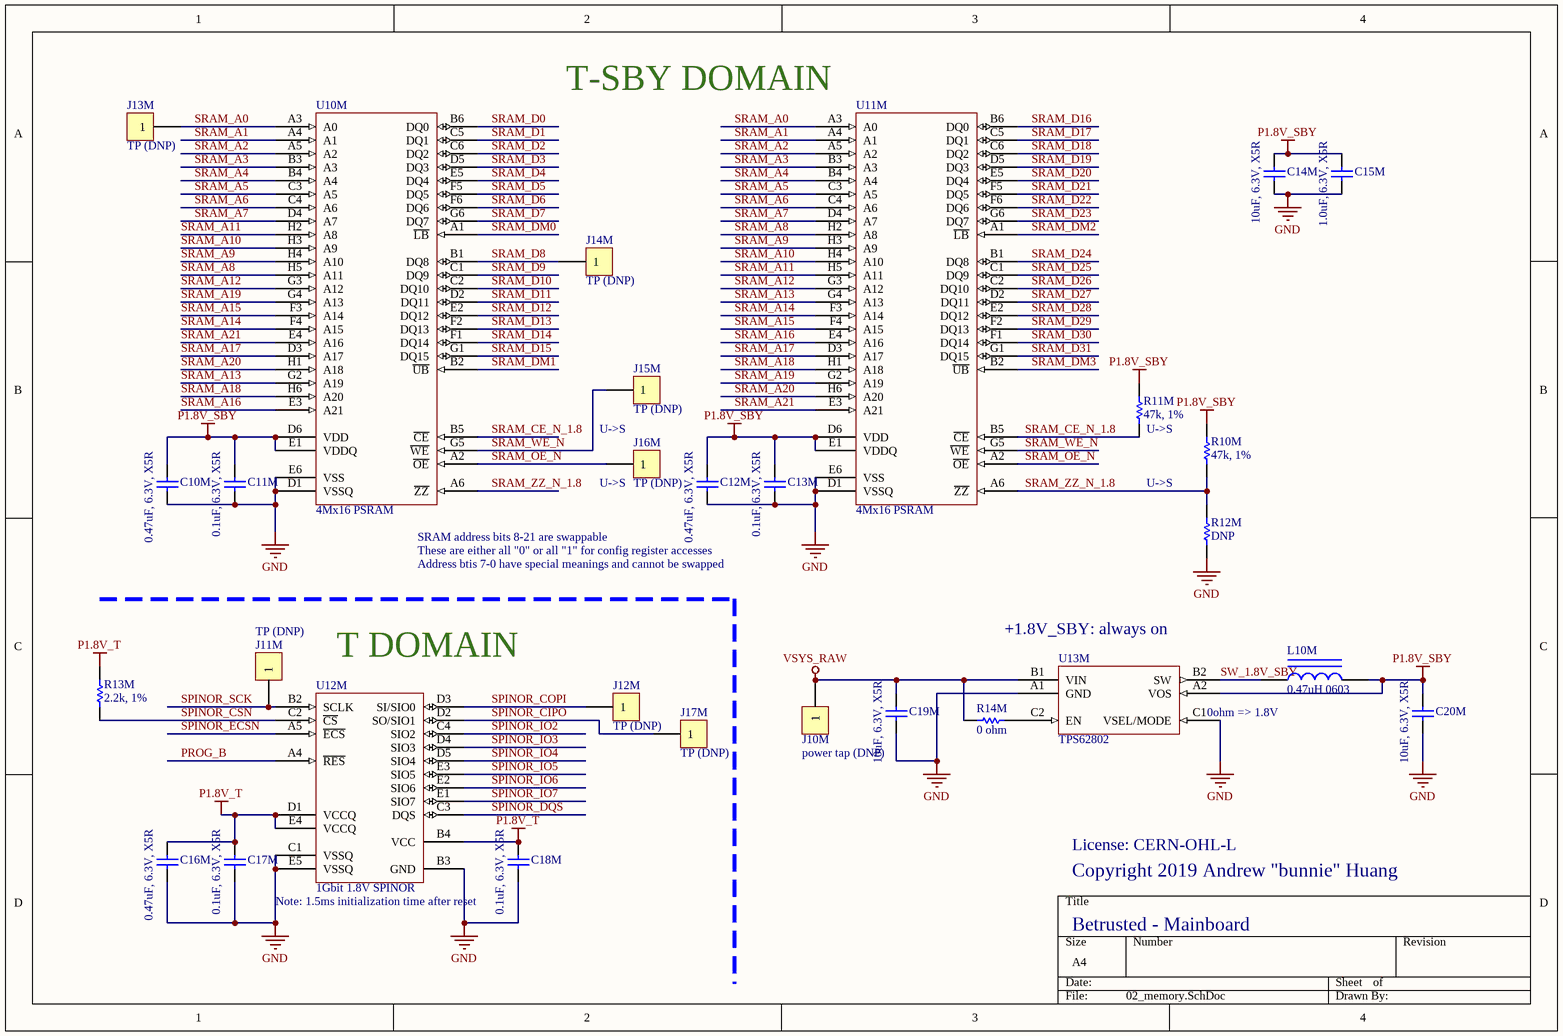
[diagram p3: 02_memory.SchDoc]

### Parts
C10M  0.47uF, 6.3V, X5R  [B_CAP0201]
C11M  0.1uF, 6.3V, X5R  [B_CAP0201]
C12M  0.47uF, 6.3V, X5R  [B_CAP0201]
C13M  0.1uF, 6.3V, X5R  [B_CAP0201]
C14M  10uF, 6.3V, X5R  [B_CAP0603]
C15M  1.0uF, 6.3V, X5R  [B_CAP0201]
C16M  0.47uF, 6.3V, X5R  [B_CAP0201]
C17M  0.1uF, 6.3V, X5R  [B_CAP0201]
C18M  0.1uF, 6.3V, X5R  [B_CAP0201]
C19M  10uF, 6.3V, X5R  [B_CAP0603]
C20M  10uF, 6.3V, X5R  [B_CAP0603]
J10M  power tap (DNP)  [RESTAP-0603]
J11M  TP (DNP)  [TP_0.4x0.4_SMT]
J12M  TP (DNP)  [TP_0.4x0.4_SMT]
J13M  TP (DNP)  [TP_0.4x0.4_SMT]
J14M  TP (DNP)  [TP_0.4x0.4_SMT]
J15M  TP (DNP)  [TP_0.4x0.4_SMT]
J16M  TP (DNP)  [TP_0.4x0.4_SMT]
J17M  TP (DNP)  [TP_0.4x0.4_SMT]
L10M  0.47uH 0603  [B_IND0603]
R10M  47k, 1%  [B_RES0201]
R11M  47k, 1%  [B_RES0201]
R12M  DNP  [B_RES0201]
R13M  2.2k, 1%  [B_RES0201]
R14M  0 ohm  [B_RES0201]
U10M  4Mx16 PSRAM  [BGA48C75P6X8_600X800X120]
U11M  4Mx16 PSRAM  [BGA48C75P6X8_600X800X120]
U12M  1Gbit 1.8V SPINOR  [BGA24C100P5X5_600X800X120]
U13M  TPS62802  [BGA6C35P2X3_70X105X40_NSMD]

### Nets
GND: C10M.2 C11M.2 C12M.2 C13M.2 C14M.2 C15M.1 C16M.2 C17M.2 C18M.2 C19M.2 C20M.2 R12M.2 U10M.D1(VSSQ) U10M.E6(VSS) U11M.D1(VSSQ) U11M.E6(VSS) U12M.B3(GND) U12M.C1(VSSQ) U12M.E5(VSSQ) U13M.A1(GND) U13M.C1(VSEL/MODE)
P1.8V_SBY: C10M.1 C11M.1 C12M.1 C13M.1 C14M.1 C15M.2 C20M.1 L10M.2 R10M.1 R11M.1 U10M.D6(VDD) U10M.E1(VDDQ) U11M.D6(VDD) U11M.E1(VDDQ) U13M.A2(VOS)
P1.8V_T: C16M.1 C17M.1 C18M.1 R13M.2 U12M.B4(VCC) U12M.D1(VCCQ) U12M.E4(VCCQ)
VSYS_RAW: C19M.1 J10M.1 R14M.1 U13M.B1(VIN)
PROG_B: U12M.A4(~{RES})
SPINOR_CIPO: J17M.1 U12M.D2(SO/SIO1)
SPINOR_COPI: J12M.1 U12M.D3(SI/SIO0)
SPINOR_CSN: R13M.1 U12M.C2(~{CS})
SPINOR_DQS: U12M.C3(DQS)
SPINOR_ECSN: U12M.A5(~{ECS})
SPINOR_IO2: U12M.C4(SIO2)
SPINOR_IO3: U12M.D4(SIO3)
SPINOR_IO4: U12M.D5(SIO4)
SPINOR_IO5: U12M.E3(SIO5)
SPINOR_IO6: U12M.E2(SIO6)
SPINOR_IO7: U12M.E1(SIO7)
SPINOR_SCK: J11M.1 U12M.B2(SCLK)
SRAM_A0: J13M.1 U10M.A3(A0) U11M.A3(A0)
SRAM_A1: U10M.A4(A1) U11M.A4(A1)
SRAM_A2: U10M.A5(A2) U11M.A5(A2)
SRAM_A3: U10M.B3(A3) U11M.B3(A3)
SRAM_A4: U10M.B4(A4) U11M.B4(A4)
SRAM_A5: U10M.C3(A5) U11M.C3(A5)
SRAM_A6: U10M.C4(A6) U11M.C4(A6)
SRAM_A7: U10M.D4(A7) U11M.D4(A7)
SRAM_A8: U10M.H5(A11) U11M.H2(A8)
SRAM_A9: U10M.H4(A10) U11M.H3(A9)
SRAM_A10: U10M.H3(A9) U11M.H4(A10)
SRAM_A11: U10M.H2(A8) U11M.H5(A11)
SRAM_A12: U10M.G3(A12) U11M.G3(A12)
SRAM_A13: U10M.G2(A19) U11M.G4(A13)
SRAM_A14: U10M.F4(A15) U11M.F3(A14)
SRAM_A15: U10M.F3(A14) U11M.F4(A15)
SRAM_A16: U10M.E3(A21) U11M.E4(A16)
SRAM_A17: U10M.D3(A17) U11M.D3(A17)
SRAM_A18: U10M.H6(A20) U11M.H1(A18)
SRAM_A19: U10M.G4(A13) U11M.G2(A19)
SRAM_A20: U10M.H1(A18) U11M.H6(A20)
SRAM_A21: U10M.E4(A16) U11M.E3(A21)
SRAM_CE_N_1.8: R11M.2 U10M.B5(~{CE}) U11M.B5(~{CE})
SRAM_D0: U10M.B6(DQ0)
SRAM_D1: U10M.C5(DQ1)
SRAM_D2: U10M.C6(DQ2)
SRAM_D3: U10M.D5(DQ3)
SRAM_D4: U10M.E5(DQ4)
SRAM_D5: U10M.F5(DQ5)
SRAM_D6: U10M.F6(DQ6)
SRAM_D7: U10M.G6(DQ7)
SRAM_D8: J14M.1 U10M.B1(DQ8)
SRAM_D9: U10M.C1(DQ9)
SRAM_D10: U10M.C2(DQ10)
SRAM_D11: U10M.D2(DQ11)
SRAM_D12: U10M.E2(DQ12)
SRAM_D13: U10M.F2(DQ13)
SRAM_D14: U10M.F1(DQ14)
SRAM_D15: U10M.G1(DQ15)
SRAM_D16: U11M.B6(DQ0)
SRAM_D17: U11M.C5(DQ1)
SRAM_D18: U11M.C6(DQ2)
SRAM_D19: U11M.D5(DQ3)
SRAM_D20: U11M.E5(DQ4)
SRAM_D21: U11M.F5(DQ5)
SRAM_D22: U11M.F6(DQ6)
SRAM_D23: U11M.G6(DQ7)
SRAM_D24: U11M.B1(DQ8)
SRAM_D25: U11M.C1(DQ9)
SRAM_D26: U11M.C2(DQ10)
SRAM_D27: U11M.D2(DQ11)
SRAM_D28: U11M.E2(DQ12)
SRAM_D29: U11M.F2(DQ13)
SRAM_D30: U11M.F1(DQ14)
SRAM_D31: U11M.G1(DQ15)
SRAM_DM0: U10M.A1(~{LB})
SRAM_DM1: U10M.B2(~{UB})
SRAM_DM2: U11M.A1(~{LB})
SRAM_DM3: U11M.B2(~{UB})
SRAM_OE_N: J16M.1 U10M.A2(~{OE}) U11M.A2(~{OE})
SRAM_WE_N: J15M.1 U10M.G5(~{WE}) U11M.G5(~{WE})
SRAM_ZZ_N_1.8: R10M.2 R12M.1 U10M.A6(~{ZZ}) U11M.A6(~{ZZ})
SW_1.8V_SBY: L10M.1 U13M.B2(SW)
NetR14M_2: R14M.2 U13M.C2(EN)

### Notes on the sheet
- T-SBY DOMAIN
- U->S
- (near R11M) U->S
- (near J16M) U->S
- (near U10M) SRAM address bits 8-21 are swappable
- These are either all "0" or all "1" for config register accesses
- Address btis 7-0 have special meanings and cannot be swapped
- (near U13M) +1.8V_SBY: always on
- (near U12M) T DOMAIN
- 0ohm => 1.8V
- License: CERN-OHL-L
- Note: 1.5ms initialization time after reset
- Copyright 2019 Andrew "bunnie" Huang
- Betrusted - Mainboard

### Library data of the parts
C10M C12M C16M = Cap Semi: as C10F on sheet 01_fpga
C11M C13M C17M C18M = Cap Semi: as C12F on sheet 01_fpga
C14M C19M C20M = Cap Semi: as C11F on sheet 01_fpga
C15M = Cap Semi: as C22F on sheet 01_fpga
J10M J11M J12M J13M J14M J15M J16M J17M = CON1: Connector; MYPN: J-TP-PWRTAP-0603; MPN: DNP; VENDOR: DNP
L10M = Inductor Iron: as L12F on sheet 01_fpga
R10M R11M = Res1: Resistor; VENDOR: ANY; MYPN: R-473-1P-1_16W-0201; MPN: ANY
R12M = Res1: Resistor; VENDOR: ANY; MYPN: DNP; MPN: ANY
R13M = Res1: Resistor; VENDOR: ANY; MYPN: R-222-1P-1_16W-0201; MPN: ANY
R14M = Res1: as R12F on sheet 01_fpga; MPN: ANY
U10M U11M = IS66WVE4M16: MPN: IS66WVE4M16EALL-70BLI; MYPN: U-IS66WVE4M16EALL-70BLI; VENDOR: ISSI
U12M = MX66UM1G45G: 1.8V 1Gbit x1/x8 OctaFlash SPINOR; MPN: MX66UM1G45GXDI00; VENDOR: Macronix; MYPN: U-MX66UM1G45GXDI00
U13M = TPS62802: as U13F on sheet 01_fpga

## Sheet 03_power.SchDoc
size A3
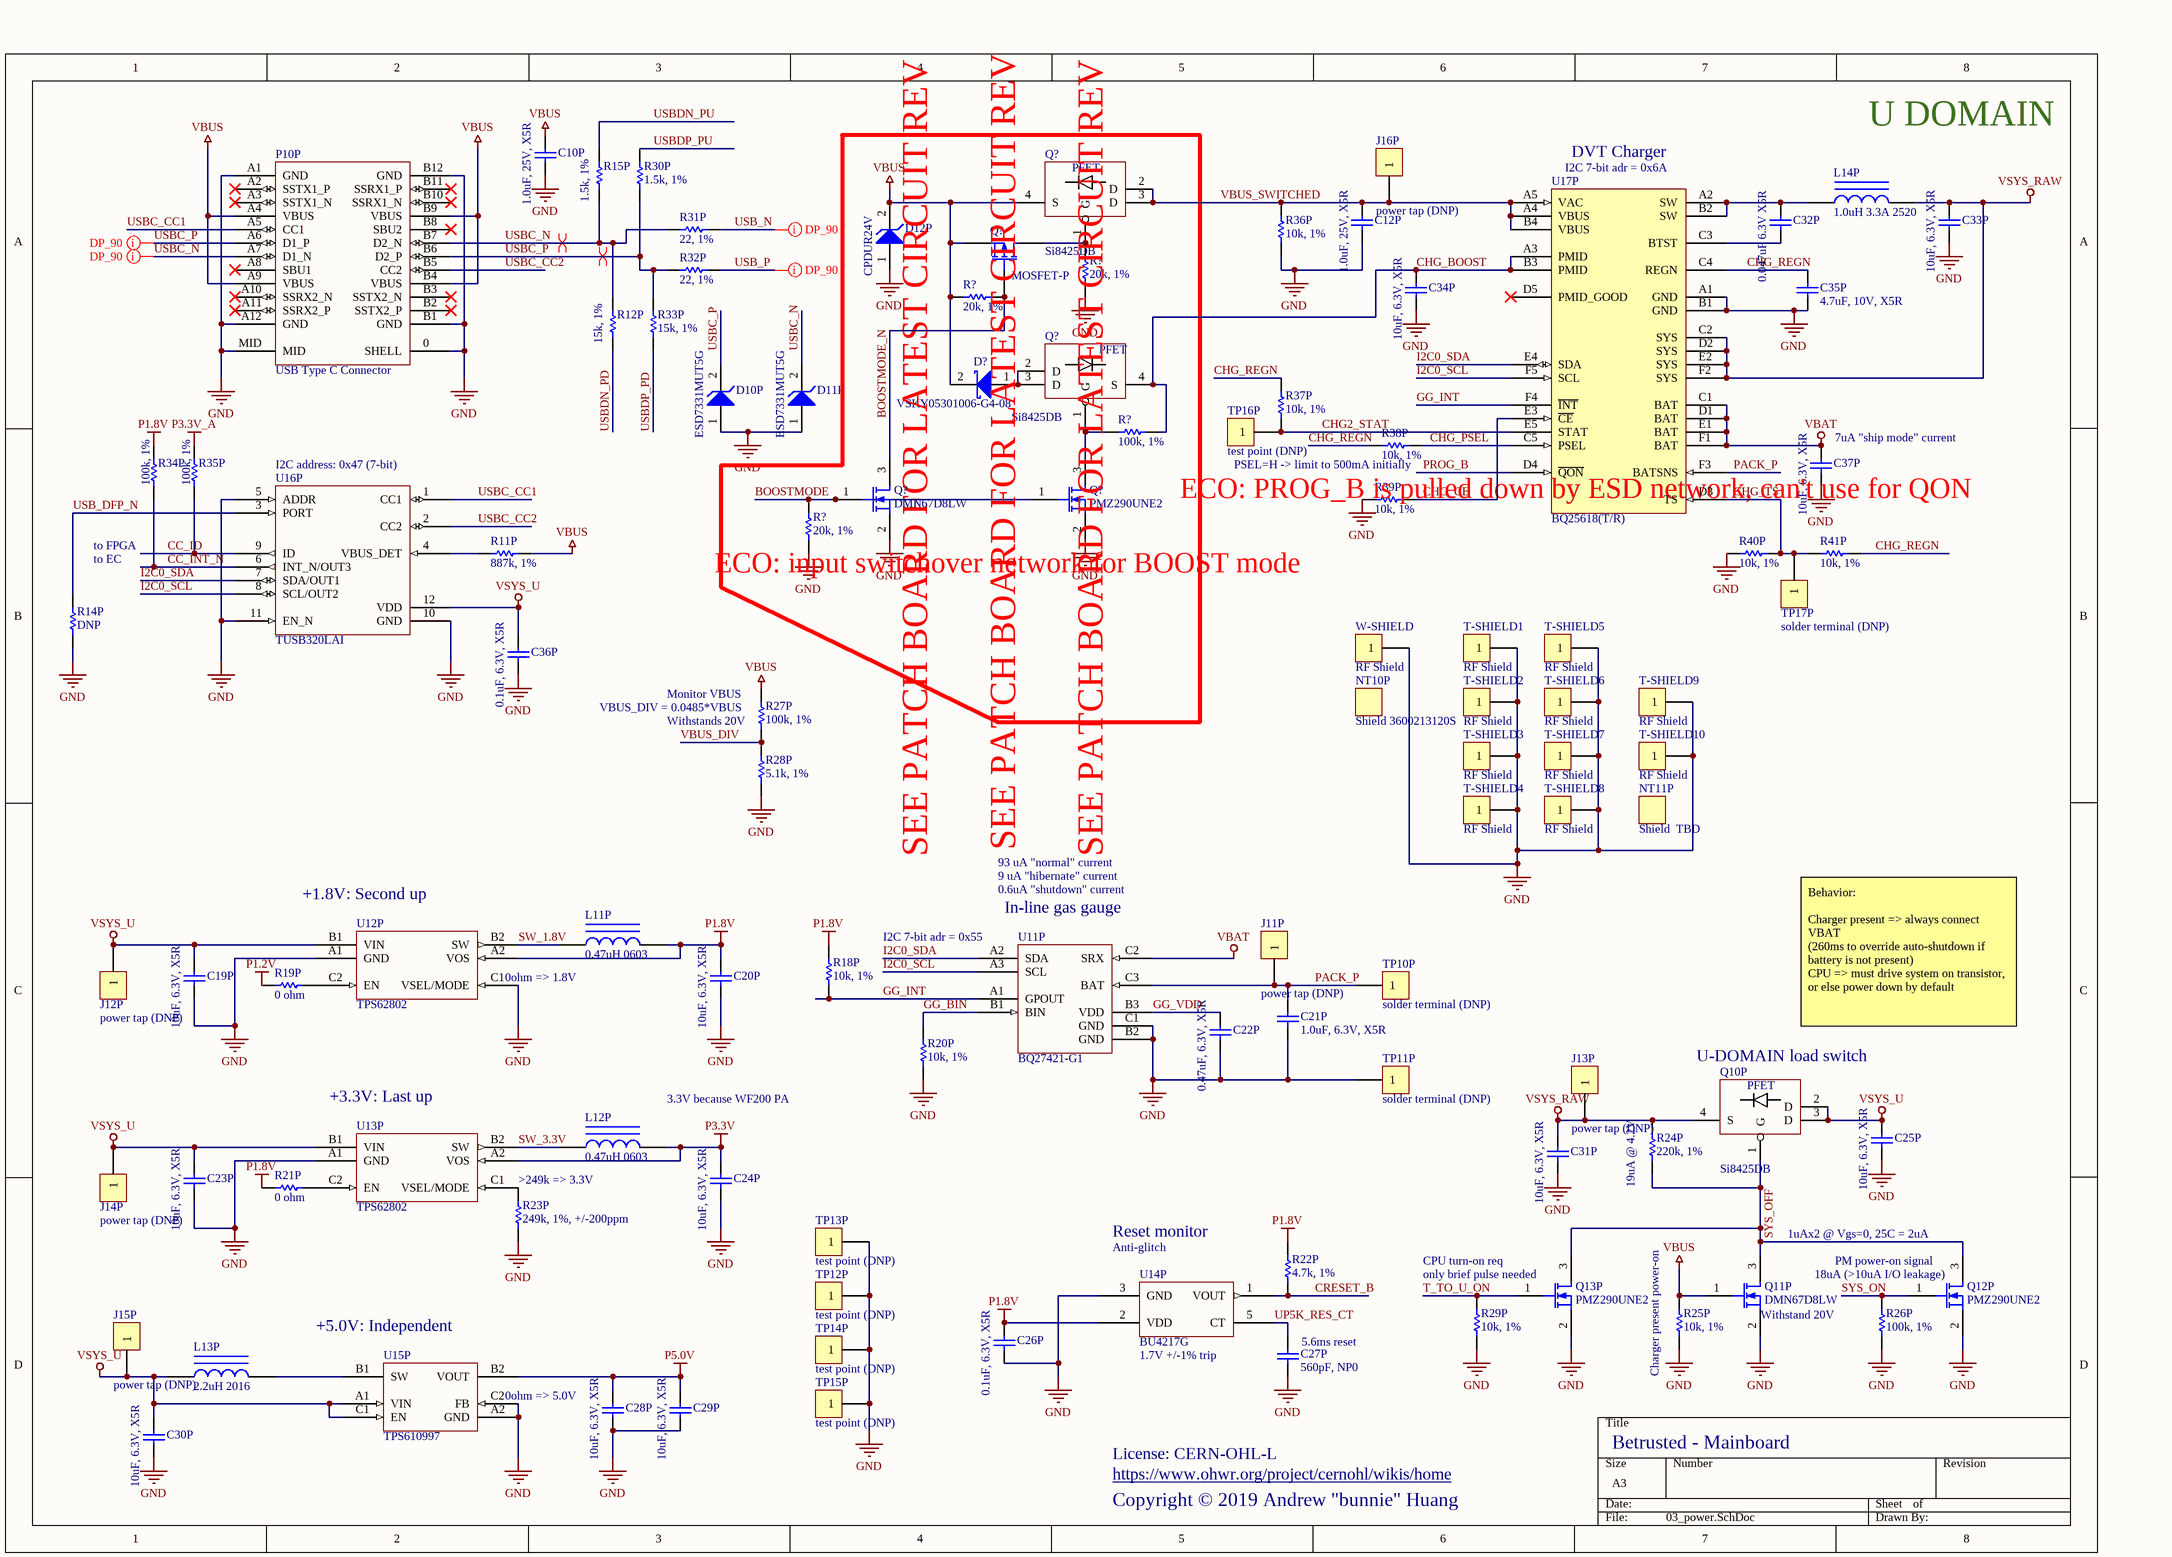
[diagram p4: 03_power.SchDoc]

### Parts
(Parts that share a designator on the sheet are numbered #1, #2 ... from top to bottom, then left to right.)
C10P  1.0uF, 25V, X5R  [B_CAP0603]
C12P  1.0uF, 25V, X5R  [B_CAP0603]
C19P  10uF, 6.3V, X5R  [B_CAP0603]
C20P  10uF, 6.3V, X5R  [B_CAP0603]
C21P  1.0uF, 6.3V, X5R  [B_CAP0201]
C22P  0.47uF, 6.3V, X5R  [B_CAP0201]
C23P  10uF, 6.3V, X5R  [B_CAP0603]
C24P  10uF, 6.3V, X5R  [B_CAP0603]
C25P  10uF, 6.3V, X5R  [B_CAP0603]
C26P  0.1uF, 6.3V, X5R  [B_CAP0201]
C27P  560pF, NP0  [B_RES0201]
C28P  10uF, 6.3V, X5R  [B_CAP0603]
C29P  10uF, 6.3V, X5R  [B_CAP0603]
C30P  10uF, 6.3V, X5R  [B_CAP0603]
C31P  10uF, 6.3V, X5R  [B_CAP0603]
C32P  0.047uF 6.3V X5R  [B_CAP0201]
C33P  10uF, 6.3V, X5R  [B_CAP0603]
C34P  10uF, 6.3V, X5R  [B_CAP0603]
C35P  4.7uF, 10V, X5R  [B_CAP0603]
C36P  0.1uF, 6.3V, X5R  [B_CAP0201]
C37P  10uF, 6.3V, X5R  [B_CAP0603]
D10P  ESD7331MUT5G  [D_X3DFN2_0201]
D11P  ESD7331MUT5G  [D_X3DFN2_0201]
D12P  CPDUR24V  [SOD523]
D?  VSKY05301006-G4-08  [B_DIO0402]
J11P  power tap (DNP)  [RESTAP-0603]
J12P  power tap (DNP)  [RESTAP-0603]
J13P  power tap (DNP)  [RESTAP-0603]
J14P  power tap (DNP)  [RESTAP-0603]
J15P  power tap (DNP)  [RESTAP-0603]
J16P  power tap (DNP)  [RESTAP-0603]
L11P  0.47uH 0603  [B_IND0603]
L12P  0.47uH 0603  [B_IND0603]
L13P  2.2uH 2016  [B_IND2016_TDK]
L14P  1.0uH 3.3A 2520  [B_IND2025_SAM]
NT10P  Shield 3600213120S
NT11P  Shield  TBD
P10P  USB Type C Connector  [TE_1-2295018-2]
Q10P  Si8425DB  [VISHAY_MICRO_FOOT_4_BUMP]
Q11P  DMN67D8LW  [SOT323-3AN]
Q12P  PMZ290UNE2  [SOT883]
Q13P  PMZ290UNE2  [SOT883]
Q?#1  Si8425DB  [VISHAY_MICRO_FOOT_4_BUMP]
Q?#2  MOSFET-P  [E3]
Q?#3  Si8425DB  [VISHAY_MICRO_FOOT_4_BUMP]
Q?#4  DMN67D8LW  [SOT323-3AN]
Q?#5  PMZ290UNE2  [SOT883]
R11P  887k, 1%  [B_RES0201]
R12P  15k, 1%  [B_RES0201]
R14P  DNP  [B_RES0201]
R15P  1.5k, 1%  [B_RES0201]
R18P  10k, 1%  [B_RES0201]
R19P  0 ohm  [B_RES0201]
R20P  10k, 1%  [B_RES0201]
R21P  0 ohm  [B_RES0201]
R22P  4.7k, 1%  [B_RES0201]
R23P  249k, 1%, +/-200ppm  [B_RES0402]
R24P  220k, 1%  [B_RES0201]
R25P  10k, 1%  [B_RES0201]
R26P  100k, 1%  [B_RES0201]
R27P  100k, 1%  [B_RES0201]
R28P  5.1k, 1%  [B_RES0201]
R29P  10k, 1%  [B_RES0201]
R30P  1.5k, 1%  [B_RES0201]
R31P  22, 1%  [B_RES0201]
R32P  22, 1%  [B_RES0201]
R33P  15k, 1%  [B_RES0201]
R34P  100k, 1%  [B_RES0201]
R35P  100k, 1%  [B_RES0201]
R36P  10k, 1%  [B_RES0201]
R37P  10k, 1%  [B_RES0201]
R38P  10k, 1%  [B_RES0201]
R39P  10k, 1%  [B_RES0201]
R40P  10k, 1%  [B_RES0201]
R41P  10k, 1%  [B_RES0201]
R?#1  20k, 1%  [B_RES0201]
R?#2  20k, 1%  [B_RES0201]
R?#3  100k, 1%  [B_RES0201]
R?#4  20k, 1%  [B_RES0201]
T-SHIELD1  RF Shield  [WURTH_36900000]
T-SHIELD2  RF Shield  [WURTH_36900000]
T-SHIELD3  RF Shield  [WURTH_36900000]
T-SHIELD4  RF Shield  [WURTH_36900000]
T-SHIELD5  RF Shield  [WURTH_36900000]
T-SHIELD6  RF Shield  [WURTH_36900000]
T-SHIELD7  RF Shield  [WURTH_36900000]
T-SHIELD8  RF Shield  [WURTH_36900000]
T-SHIELD9  RF Shield  [WURTH_36900000]
T-SHIELD10  RF Shield  [WURTH_36900000]
TP10P  solder terminal (DNP)  [55-MIL-HOLE]
TP11P  solder terminal (DNP)  [55-MIL-HOLE]
TP12P  test point (DNP)  [TP_2MM_SQ]
TP13P  test point (DNP)  [TP_2MM_SQ]
TP14P  test point (DNP)  [TP_2MM_SQ]
TP15P  test point (DNP)  [TP_2MM_SQ]
TP16P  test point (DNP)  [TP_2MM_SQ]
TP17P  solder terminal (DNP)  [55-MIL-HOLE]
U11P  BQ27421-G1  [BGA9C50P3X3_162X158X62]
U12P  TPS62802  [BGA6C35P2X3_70X105X40_NSMD]
U13P  TPS62802  [BGA6C35P2X3_70X105X40_NSMD]
U14P  BU4217G  [SOT23-5AN]
U15P  TPS610997  [BGA6C40P2X3_88X123X62]
U16P  TUSB320LAI  [QFN40P160X160X40-12N]
U17P  BQ25618(T/R)  [BGA30C40P5X6_196X236X62]
W-SHIELD  RF Shield  [WURTH_36X021312XS]

### Blocks framed on the sheet
ECO: PROG_B is pulled down by ESD network, can't use for QON: D12P D? Q?#1-Q?#5 R?#1-R?#4

### Nets
GND: C10P.2 C12P.2 C19P.2 C20P.2 C21P.1 C22P.2 C23P.2 C24P.2 C25P.2 C26P.2 C27P.2 C28P.2 C29P.2 C30P.2 C31P.2 C33P.2 C34P.2 C35P.1 C36P.2 C37P.2 D10P.1(A) D11P.1(A) D12P.1(A) P10P.0(SHELL) P10P.A1(GND) P10P.A12(GND) P10P.B1(GND) P10P.B12(GND) P10P.MID Q11P.2(S) Q12P.2(S) Q13P.2(S) Q?#4.2(S) Q?#5.2(S) R14P.2 R20P.2 R23P.2 R25P.2 R26P.1 R28P.2 R29P.2 R36P.1 R39P.1 R40P.1 R?#1.1 R?#4.1 T-SHIELD1.1 T-SHIELD2.1 T-SHIELD3.1 T-SHIELD4.1 T-SHIELD5.1 T-SHIELD6.1 T-SHIELD7.1 T-SHIELD8.1 T-SHIELD9.1 T-SHIELD10.1 TP11P.1 TP12P.1 TP13P.1 TP14P.1 TP15P.1 U11P.B2(GND) U11P.C1(GND) U12P.A1(GND) U12P.C1(VSEL/MODE) U13P.A1(GND) U14P.3(GND) U15P.A2(GND) U15P.C2(FB) U16P.5(ADDR) U16P.10(GND) U16P.11(EN_N) U17P.A1(GND) U17P.B1(GND) W-SHIELD.1
P1.2V: R19P.1
P1.8V: C20P.1 C26P.1 L11P.2 R18P.1 R21P.1 R22P.2 R34P.2 U12P.A2(VOS) U14P.2(VDD)
P3.3V: C24P.1 L12P.2 U13P.A2(VOS)
P3.3V_A: R35P.2
P5.0V: C28P.1 C29P.1 U15P.B2(VOUT)
PACK_P: C21P.2 J11P.1 TP10P.1 U11P.C3(BAT) U17P.F3(BATSNS)
VBAT: C37P.1 U11P.C2(SRX) U17P.C1(BAT) U17P.D1(BAT) U17P.E1(BAT) U17P.F1(BAT)
VBUS: C10P.1 D12P.2(K) D?.2(K) P10P.A4(VBUS) P10P.A9(VBUS) P10P.B4(VBUS) P10P.B9(VBUS) Q11P.1(G) Q?#1.4(S) Q?#2.3(S) R11P.1 R25P.1 R27P.2 R?#2.2
VSYS_RAW: C31P.1 C33P.1 J13P.1 L14P.2 Q10P.4(S) R24P.2 U17P.C2(SYS) U17P.D2(SYS) U17P.E2(SYS) U17P.F2(SYS)
VSYS_U: C19P.1 C23P.1 C25P.1 C30P.1 C36P.1 J12P.1 J14P.1 J15P.1 L13P.1 Q10P.2(D) Q10P.3(D) U12P.B1(VIN) U13P.B1(VIN) U15P.A1(VIN) U15P.C1(EN) U16P.12(VDD)
BOOSTMODE: Q?#4.1(G) Q?#5.1(G) R?#4.2
BOOSTMODE_N: Q?#2.2(G) Q?#4.3(D) R?#2.1
CC_ID: R35P.1 U16P.9(ID)
CC_INT_N: R34P.1 U16P.6(INT_N/OUT3)
CHG2_STAT: R37P.2 TP16P.1 U17P.E5(STAT)
CHG_BOOST: C34P.1 Q?#3.4(S) R?#3.1 U17P.A3(PMID) U17P.B3(PMID)
CHG_CE: R39P.2 U17P.E3(~{CE})
CHG_PSEL: R38P.2 U17P.C5(PSEL)
CHG_REGN: C35P.2 R37P.1 R38P.1 R41P.2 U17P.C4(REGN)
CHG_TS: R40P.2 R41P.1 TP17P.1 U17P.D3(TS)
CRESET_B: R22P.1 U14P.1(VOUT)
GG_BIN: R20P.1 U11P.B1(BIN)
GG_INT: R18P.2 U11P.A1(GPOUT) U17P.F4(~{INT})
GG_VDD: C22P.1 U11P.B3(VDD)
I2C0_SCL: U11P.A3(SCL) U16P.8(SCL/OUT2) U17P.F5(SCL)
I2C0_SDA: U11P.A2(SDA) U16P.7(SDA/OUT1) U17P.E4(SDA)
PROG_B: U17P.D4(~{QON})
SW_1.8V: L11P.1 U12P.B2(SW)
SW_3.3V: L12P.1 U13P.B2(SW)
SYS_OFF: Q10P.1(G) Q11P.3(D) Q12P.3(D) Q13P.3(D) R24P.1
SYS_ON: Q12P.1(G) R26P.2
T_TO_U_ON: Q13P.1(G) R29P.1
UP5K_RES_CT: C27P.1 U14P.5(CT)
USB_DFP_N: R14P.1 U16P.3(PORT)
USB_N: R31P.2
USB_P: R32P.2
USBC_CC1: P10P.A5(CC1) U16P.1(CC1)
USBC_CC2: P10P.B5(CC2) U16P.2(CC2)
USBC_N: D11P.2(K) P10P.A7(D1_N) P10P.B7(D2_N) R12P.1 R15P.1 R31P.1
USBC_P: D10P.2(K) P10P.A6(D1_P) P10P.B6(D2_P) R30P.1 R32P.1 R33P.1
USBDN_PD: R12P.2
USBDN_PU: R15P.2
USBDP_PD: R33P.2
USBDP_PU: R30P.2
VBUS_DIV: R27P.1 R28P.1
VBUS_SWITCHED: C12P.1 J16P.1 Q?#1.2(D) Q?#1.3(D) R36P.2 U17P.A4(VBUS) U17P.A5(VAC) U17P.B4(VBUS)
NetC32P_1: C32P.1 L14P.1 U17P.A2(SW) U17P.B2(SW)
NetC32P_2: C32P.2 U17P.C3(BTST)
NetD?_1: D?.1(A) Q?#3.2(D) Q?#3.3(D)
NetL13P_2: L13P.2 U15P.B1(SW)
NetQ?#1_1: Q?#1.1(G) Q?#2.1(D) R?#1.2
NetQ?#3_1: Q?#3.1(G) Q?#5.3(D) R?#3.2
NetR11P_2: R11P.2 U16P.4(VBUS_DET)
NetR19P_2: R19P.2 U12P.C2(EN)
NetR21P_2: R21P.2 U13P.C2(EN)
NetR23P_1: R23P.1 U13P.C1(VSEL/MODE)

Not connected (* = marked no-connect by the designer): P10P A2(SSTX1_P)* A3(SSTX1_N)* A8(SBU1)* A10(SSRX2_N)* A11(SSRX2_P)* B2(SSTX2_P)* B3(SSTX2_N)* B8(SBU2)* B10(SSRX1_N)* B11(SSRX1_P)*; U17P D5(PMID_GOOD)*

### Layout directives
differential pair: USBC_N, USBC_P
net class DP_90: USB_N, USB_P, USBC_N, USBC_P

### Notes on the sheet
- (near U17P) DVT Charger
- U DOMAIN
- (near U17P) I2C 7-bit adr = 0x6A
- (near U16P) I2C address: 0x47 (7-bit)
- (near R38P) PSEL=H -> limit to 500mA initially
- (near C37P) 7uA "ship mode" current
- (near R14P) to EC
- to FPGA
- (near R?#4) ECO: input switchover network for BOOST mode
- (near R27P) Monitor VBUS
- (near R27P) VBUS_DIV = 0.0485*VBUS
- (near R27P) Withstands 20V
- (near U12P) +1.8V: Second up
- SEE PATCH BOARD FOR LATEST CIRCUIT REV
- 93 uA "normal" current
- 0.6uA "shutdown" current
- 9 uA "hibernate" current
- (near Q?#1) SEE PATCH BOARD FOR LATEST CIRCUIT REV
- (near U11P) I2C 7-bit adr = 0x55
- (near U11P) In-line gas gauge
- 0ohm => 1.8V
- Behavior:
  Charger present => always connect VBAT
  (260ms to override auto-shutdown if battery is not present)
  CPU => must drive system on transistor, or else power down by default
- (near U13P) +3.3V: Last up
- 3.3V because WF200 PA
- (near Q10P) U-DOMAIN load switch
- (near R23P) >249k => 3.3V
- Reset monitor
- (near R24P) 19uA @ 4.2V
- 1uAx2 @ Vgs=0, 25C = 2uA
- (near U14P) Anti-glitch
- CPU turn-on req
- (near Q13P) only brief pulse needed
- (near Q12P) 18uA (>10uA I/O leakage)
- (near Q12P) PM power-on signal
- (near U15P) +5.0V: Independent
- (near U14P) 1.7V +/-1% trip
- (near C27P) 5.6ms reset
- (near R25P) Charger present power-on
- (near Q11P) Withstand 20V
- 0ohm => 5.0V
- License: CERN-OHL-L
- Copyright © 2019 Andrew "bunnie" Huang
- https://www.ohwr.org/project/cernohl/wikis/home
- Betrusted - Mainboard
- (in symbol Si8425DB) PFET

### Library data of the parts
C10P C12P = Cap Semi: as C63F on sheet 01_fpga
C19P C20P C23P C24P C25P C28P C29P C30P C31P C33P C34P C37P = Cap Semi: as C11F on sheet 01_fpga
C21P = Cap Semi: as C22F on sheet 01_fpga
C22P = Cap Semi: as C10F on sheet 01_fpga
C26P C36P = Cap Semi: as C12F on sheet 01_fpga
C27P = Cap Semi: as C34F on sheet 01_fpga
C32P = Cap Semi: Capacitor (Semiconductor SIM Model); MPN: GRM033C81A473KE05D; VENDOR: Murata; MYPN: C-473-10-X6S-0201
C35P = Cap Semi: Capacitor (Semiconductor SIM Model); MPN: CL10A475KP8NNNC; VENDOR: Samsung; MYPN: C-475-10-X5R-0603
D10P D11P = D Zener: VENDOR: ON Semi; MYPN: D-ESD7331MUT5G; Published: 8-Jun-2000; LatestRevisionDate: 17-Jul-2002; LatestRevisionNote: Re-released for DXP Platform.; PackageReference: DIODE-0.7; Publisher: Altium Limited; PackageDescription: Diode, Thru-Hole; 2 Leads; 0.7 in Pin Spacing; MPN: ESD7331MUT5G
D12P = D Zener: VENDOR: Comchip Technology; MYPN: D-CPDUR24V; Published: 8-Jun-2000; LatestRevisionDate: 17-Jul-2002; LatestRevisionNote: Re-released for DXP Platform.; PackageReference: DIODE-0.7; Publisher: Altium Limited; PackageDescription: Diode, Thru-Hole; 2 Leads; 0.7 in Pin Spacing; MPN: CPDUR24V
D? = Diode 11DQ03: Schottky Rectifier; MYPN: D-SCHOTTKY-0402-CSP; VENDOR: Vishay; ComponentLink1Description: Manufacturer Link; ComponentLink1URL: http://www.irf.com/; ComponentLink2Description: Datasheet; ComponentLink2URL: http://www.irf.com/product-info/datasheets/data/11dq03.pdf; MPN: VSKY05301006-G4-08
J11P J12P J13P J14P J15P J16P = CON1: Connector; MYPN: J-TP-PWRTAP-0603; MPN: DNP; VENDOR: DNP
L11P L12P = Inductor Iron: as L12F on sheet 01_fpga
L13P = Inductor Iron: Magnetic-Core Inductor; MPN: VLS201610CX-2R2M-1; VENDOR: TDK; MYPN: L-VLS201610CX-2R2M-1
L14P = Inductor Iron: Magnetic-Core Inductor; MPN: CIGW252010GL1R0MNE; VENDOR: Samsung; MYPN: L-CIGW252010GL1R0MNE
NT10P = NOTE: RF Shield snap-on; MYPN: NT-3600213120S; VENDOR: Wurth; MPN: 3600213120S
NT11P = NOTE: RF Shield snap-on; VENDOR: Placeholder; MPN: TBD; MYPN: TBD
P10P = USB_TYPE_C: MPN: 1-2295018-2; VENDOR: TE Connectivity AMP Connectors; MYPN: P-1-2295018-2
Q10P Q?#1 Q?#3 = Si8425DB: as Q10F on sheet 01_fpga
Q11P Q?#4 = MOSFET-N: as Q12F on sheet 01_fpga; Published: 8-Jun-2000; LatestRevisionDate: 17-Jul-2002; LatestRevisionNote: Re-released for DXP Platform.; PackageVersion: 1995/1996; PackageReference: E3; Publisher: Altium Limited; MPN: DMN67D8LW
Q12P Q13P Q?#5 = MOSFET-N: as Q11F on sheet 01_fpga; Published: 8-Jun-2000; LatestRevisionDate: 17-Jul-2002; LatestRevisionNote: Re-released for DXP Platform.; PackageVersion: 1995/1996; PackageReference: E3; Publisher: Altium Limited; MPN: PMZ290UNE2
Q?#2 = MOSFET-P: P-Channel MOSFET; Published: 8-Jun-2000; LatestRevisionDate: 17-Jul-2002; LatestRevisionNote: Re-released for DXP Platform.; PackageVersion: 1995/1996; PackageReference: E3; Publisher: Altium Limited; PackageDescription: TO, Flat Index; 3 In-Line, Axial Leads; Body Dia. 4.6mm; Lead Dia. 0.5 mm (max)
R11P = Res1: Resistor; VENDOR: ANY; MYPN: R-8873-1P-1_16W-0201; MPN: ANY
R12P R33P = Res1: Resistor; VENDOR: ANY; MYPN: R-153-1P-1_16W-0201; MPN: ANY
R14P = Res1: Resistor; VENDOR: ANY; MYPN: DNP; MPN: ANY
R15P R30P = Res1: Resistor; VENDOR: ANY; MYPN: R-152-1P-1_16W-0201; MPN: ANY
R18P R20P R25P R29P R36P R37P R38P R39P R40P R41P = Res1: as R27F on sheet 01_fpga; MPN: ANY
R19P R21P = Res1: as R12F on sheet 01_fpga; MPN: ANY
R22P = Res1: as R15F on sheet 01_fpga; MPN: ANY
R23P = Res1: Resistor; MPN: RC0402FR-07249KL; VENDOR: Yageo; MYPN: R-2493-1P-1_16W-0402
R24P = Res1: as R10F on sheet 01_fpga; MPN: ANY
R26P R27P R34P R35P R?#3 = Res1: as R14F on sheet 01_fpga; MPN: ANY
R28P = Res1: Resistor; VENDOR: ANY; MYPN: R-512-1P-1_16W-0201; MPN: ANY
R31P R32P = Res1: Resistor; VENDOR: ANY; MYPN: R-220-1P-1_16W-0201; MPN: ANY
R?#1 R?#2 R?#4 = Res1: Resistor; VENDOR: ANY; MYPN: R-203-1P-1_16W-0201; MPN: ANY
T-SHIELD1-T-SHIELD10 = CON1: Connector; MPN: 36900000; MYPN: J-36900000; VENDOR: Wurth
TP10P TP11P TP12P TP13P TP14P TP15P TP16P TP17P = CON1: Connector; MYPN: Built into PCB; MPN: DNP; VENDOR: DNP
U11P = BQ27421-G1: System-Side Impedance Track Fuel Gauge with integrated Sense Resistor; MPN: bq27421YZFT-G1A; VENDOR: TI; MYPN: bq27421YZF(T/R)-G1A
U12P U13P = TPS62802: as U13F on sheet 01_fpga
U14P = BU42XXG: as U14F on sheet 01_fpga
U15P = TPS610997: Synchronous Boost Converter with Ultra-Low Iq; MPN: TPS610997YFFR; VENDOR: TI; MYPN: TPS610997YFFT(T/R)
U16P = TUSB320LAI: USB Type-C Configuration Channel Logic and Port Control; VENDOR: TI; MYPN: U-TUSB320LAI; MPN: TUSB320LAI
U17P = BQ25618: I2C controlled 1-cell 1.5A battery charger with 20mA termination and 1A boost operation; MPN: BQ25618YFFT; VENDOR: TI; MYPN: U-BQ25618YFF(T/R)
W-SHIELD = CON1: Connector; MPN: 3610213126S; VENDOR: Wurth; MYPN: 3610213126S